# EAGLE design OBD_Board Ver1 (EAGLE 8.0.0)

## Sheet 1 of 2
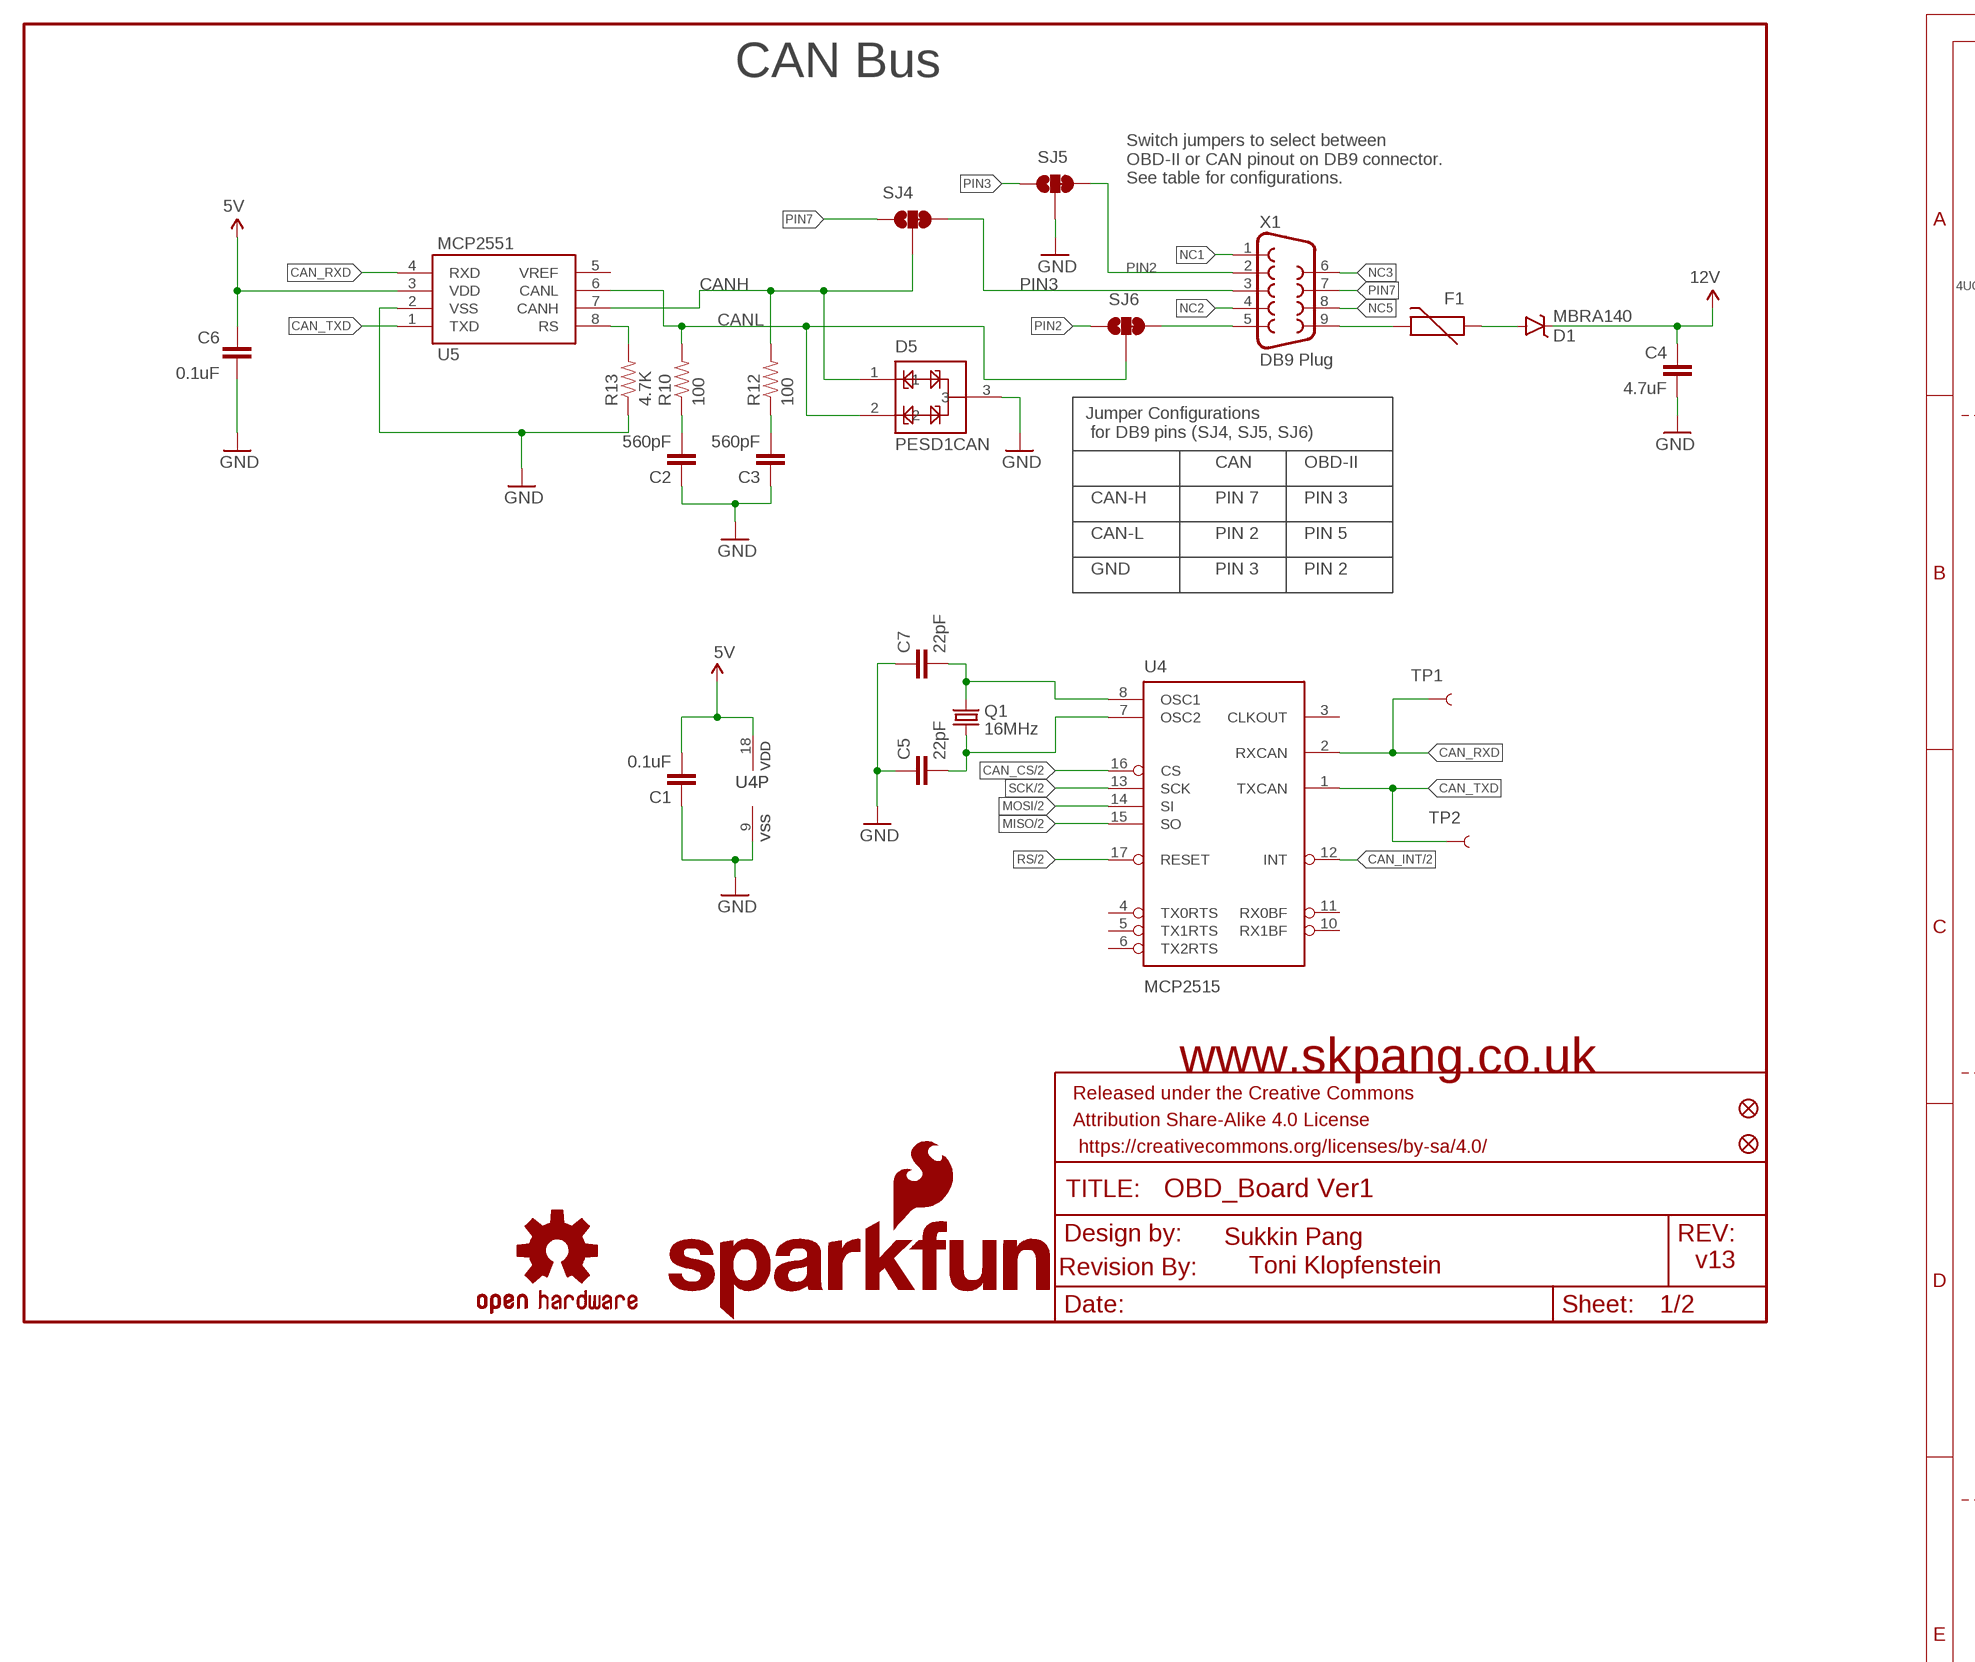
[diagram p0: schematic, sheet 1, part 1 of 2]
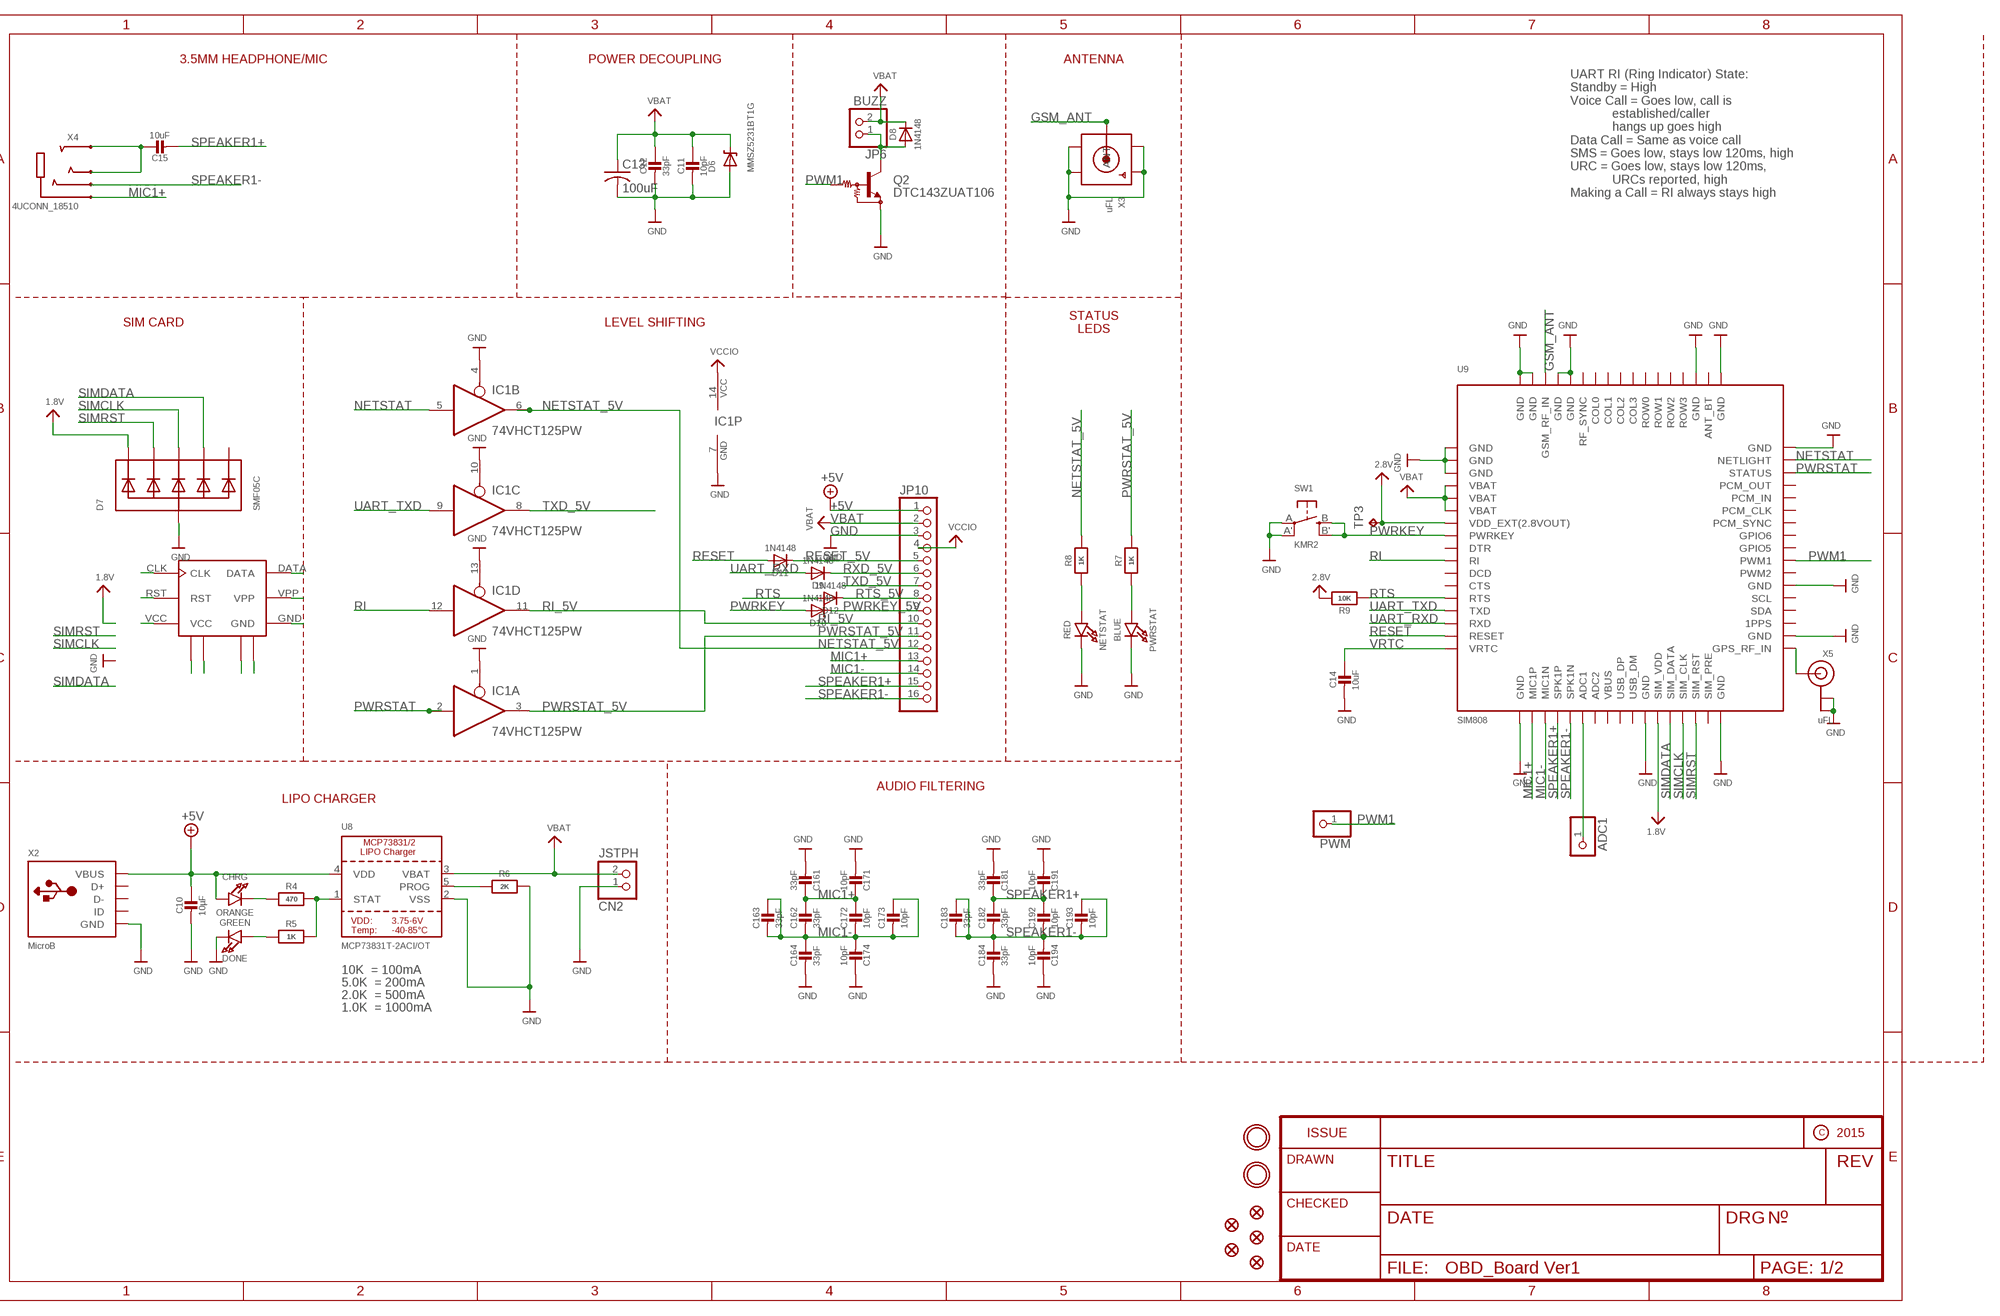
[diagram p1: schematic, sheet 1, part 2 of 2]

### Parts
ADC1  PINHD-1X1CB  [1X01-CLEANBIG]
C1  0.1uF  0.1UF-25V(+80/-20%)(0603)  [0603-CAP]
C2  560pF  560PF-50V-5%(0603)  [0603-CAP]
C3  560pF  560PF-50V-5%(0603)  [0603-CAP]
C4  4.7uF  4.7UF-6.3V-10%(0603)0603  [0603-CAP]
C5  22pF  22PF-50V-5%(0603)  [0603-CAP]
C6  0.1uF  0.1UF-25V(+80/-20%)(0603)  [0603-CAP]
C7  22pF  22PF-50V-5%(0603)  [0603-CAP]
C10  10µF  CAP_CERAMIC0805-NOOUTLINE  [0805-NO]
C11  10pF  CAP_CERAMIC0805-NOOUTLINE  [0805-NO]
C12  33pF  CAP_CERAMIC0805-NOOUTLINE  [0805-NO]
C13  100uF  C-USC1210  [C1210]
C14  10uF  CAP_CERAMIC0805-NOOUTLINE  [0805-NO]
C15  10uF  CAP_CERAMIC0805-NOOUTLINE  [0805-NO]
C16  33pF  CAP_4PACK1206  [RESPACK_4X0603]
C17  10pF  CAP_4PACK1206  [RESPACK_4X0603]
C18  33pF  CAP_4PACK1206  [RESPACK_4X0603]
C19  10pF  CAP_4PACK1206  [RESPACK_4X0603]
CHRG  ORANGE  LED0805_NOOUTLINE  [CHIPLED_0805_NOOUTLINE]
CN2  JSTPH  JST_2PIN  [JSTPH2]
D1  MBRA140  [SMA-DIODE]
D5  PESD1CAN  [SOT23-3]
D6  MMSZ5231BT1G  DIODE-ZENERSOD123  [SOD-123]
D7  SMF05C  TVSARRAY_5LANE  [SOT363]
D8  1N4148  DIODESOD-323  [SOD-323]
D9  1N4148  DIODESOD-323  [SOD-323]
D10  1N4148  DIODESOD-323  [SOD-323]
D11  1N4148  DIODESOD-323  [SOD-323]
D12  1N4148  DIODESOD-323  [SOD-323]
DONE  GREEN  LED0805_NOOUTLINE  [CHIPLED_0805_NOOUTLINE]
F1  PTCTHERMISTOR1206  [PTC-1206]
FID1  FIDUCIAL""  [FIDUCIAL_1MM]
FID2  FIDUCIAL""  [FIDUCIAL_1MM]
FID3  FIDUCIAL""  [FIDUCIAL_1MM]
FID4  FIDUCIAL""  [FIDUCIAL_1MM]
FID5  FIDUCIAL""  [FIDUCIAL_1MM]
FRAME1  FRAME-LETTER  [CREATIVE_COMMONS]
IC1  74VHCT125PW  74ABT125PW  [TSSOP14]
JP2  FIDUCIAL1X2  [FIDUCIAL-1X2]
JP3  FIDUCIAL1X2  [FIDUCIAL-1X2]
JP4  SFE_LOGO_NAME_FLAME.1_INCH  [SFE_LOGO_NAME_FLAME_.1]
JP6  BUZZ  HEADER-1X2ROUND  [1X02_ROUND]
JP10  HEADER-1X16ROUND  [1X16_ROUND]
LOGO1  OSHW-LOGOM  [OSHW-LOGO-M]
NETSTAT  RED  LED0805_NOOUTLINE  [CHIPLED_0805_NOOUTLINE]
PWM  PINHD-1X1CB  [1X01-CLEANBIG]
PWRSTAT  BLUE  LED0805_NOOUTLINE  [CHIPLED_0805_NOOUTLINE]
Q1  16MHz  CRYSTAL5X3  [CRYSTAL-SMD-5X3]
Q2  DTC143ZUAT106  MUN2211T1-NPN_DRIVER-SC59-BEC  [SC59-BEC]
R4  470  RESISTOR0805_NOOUTLINE  [0805-NO]
R5  1K  RESISTOR0805_NOOUTLINE  [0805-NO]
R6  2K  RESISTOR0805_NOOUTLINE  [0805-NO]
R7  1K  RESISTOR0805_NOOUTLINE  [0805-NO]
R8  1K  RESISTOR0805_NOOUTLINE  [0805-NO]
R9  10K  RESISTOR0805_NOOUTLINE  [0805-NO]
R10  100  100OHM-1/10W-1%(0603)  [0603-RES]
R12  100  100OHM-1/10W-1%(0603)  [0603-RES]
R13  4.7K  4.7KOHM-1/10W-1%(0603)  [0603-RES]
SJ4  JUMPER-PAD-3-2OF3_NC_BY_TRACE_SMALL  [PAD-JUMPER-3-2OF3_NC_BY_TRACE_YES_SILK_FULL_BOX]
SJ5  JUMPER-PAD-3-2OF3_NC_BY_TRACE_SMALL  [PAD-JUMPER-3-2OF3_NC_BY_TRACE_YES_SILK_FULL_BOX]
SJ6  JUMPER-PAD-3-2OF3_NC_BY_TRACE_SMALL  [PAD-JUMPER-3-2OF3_NC_BY_TRACE_YES_SILK_FULL_BOX]
SW1  KMR2  SWITCH_TACT_SMT4.6X2.8  [BTN_KMR2_4.6X2.8]
TP1  TEST-POINT3X5  [PAD.03X.05]
TP2  TEST-POINT3X5  [PAD.03X.05]
TP3  TPTP11R  [TP11R]
U4  MCP2515  MCP2510SO  [SO-18W]
U5  MCP2551  [SO08]
U8  MCP73831T-2ACI/OT  MCP73831/2  [SOT23-5]
U9  SIM808  GSM_SIM808_LITERAL  [SIM900_SMT]
U$1  REVISION  [REVISION]
U$25  SCU-W0822XR-06  [SCU-W0822XR-06]
U$33  MOUNTINGHOLE2.5  [MOUNTINGHOLE_2.5_PLATED]
U$34  MOUNTINGHOLE2.5  [MOUNTINGHOLE_2.5_PLATED]
X1  DB9 Plug  DB9MALE  [DB9_MALE]
X2  MicroB  USBMICRO_20329  [4UCONN_20329]
X3  uFL  SMACONNECTOR_EDGE_UFL  [SMA_EDGELAUNCH_UFL]
X4  4UCONN_18510  AUDIO_3.5MMJACK_4POL  [4UCONN_18510]
X5  uFL  ANTENNA_U.FL  [U.FL]

### Nets
1.8V: D7.1(C1) U9.P$29(SIM_VDD) U$25.VCC
2.8V: R9.2 TP3.TP U9.P$7(VDD_EXT(2.8VOUT))
5V: C1.2 C6.2 U4.18(VDD) U5.3(VDD) ; also sheet 2
12V: C4.1 D1.C ; also sheet 2
+5V: C10.1 CHRG.A JP10.1 U8.4(VDD) X2.VBUS
CAN_CS: U4.16(CS) ; also sheet 2
CAN_INT: U4.12(INT) ; also sheet 2
CAN_RXD: TP1.P$1 U4.2(RXCAN) U5.4(RXD)
CAN_TXD: TP2.P$1 U4.1(TXCAN) U5.1(TXD)
CANH: D5.1 R12.2 SJ4.2 U5.7(CANH)
CANL: D5.2 R10.2 SJ6.2 U5.6(CANL)
GND: C1.1 C2.1 C3.1 C4.2 C5.1 C6.1 C7.1 C10.2 C11.2 C12.2 C13.2 C14.2 C16.5 C16.8 C17.4 C17.8 C18.5 C18.8 C19.4 C19.8 CN2.1 D5.3 D6.A D7.2(A) DONE.C IC1.1(A:OE) IC1.4(B:OE) IC1.7(P:GND) IC1.10(C:OE) IC1.13(D:OE) JP10.3 NETSTAT.C PWRSTAT.C Q2.E R6.2 R13.1 SJ5.2 SW1.A'(P1) SW1.A(P) U4.9(VSS) U5.2(VSS) U8.2(VSS) U9.P$1(GND) U9.P$2(GND) U9.P$3(GND) U9.P$18(GND) U9.P$28(GND) U9.P$34(GND) U9.P$36(GND) U9.P$40(GND) U9.P$51(GND) U9.P$52(GND) U9.P$54(GND) U9.P$64(GND) U9.P$65(GND) U9.P$67(GND) U9.P$68(GND) U$25.GND U$25.GND_1(GND1) U$25.GND_2(GND2) U$25.GND_3(GND3) U$25.GND_4(GND4) X2.BASE@1(GND) X2.BASE@2(GND) X2.GND X2.SPRT@1(GND) X2.SPRT@2(GND) X2.SPRT@3(GND) X2.SPRT@4(GND) X3.GND@1(GND1) X3.GND@2(GND2) X3.GND@3(GND3) X3.GND@4(GND4) X5.1(GND) X5.2(GND) ; also sheet 2
GSM_ANT: U9.P$66(GSM_RF_IN) X3.P(ANT)
HP+: C15.1 X4.2-TIP(RING3) X4.3-OUTER_SLEEVE(RING2)
MIC1+: C16.1 C16.2 C17.1 C17.2 JP10.13 U9.P$19(MIC1P) X4.1-GND(TIP)
MIC1-: C16.3 C16.4 C16.6 C16.7 C17.3 C17.5 C17.6 C17.7 JP10.14 U9.P$20(MIC1N)
MISO: U4.15(SO) ; also sheet 2
MOSI: U4.14(SI) ; also sheet 2
N$2: SJ6.3 X1.5
N$3: CHRG.C R4.1
N$7: R4.2 R5.2 U8.1(STAT)
N$8: R6.1 U8.5(PROG)
N$9: C2.2 R10.1
N$10: C3.2 R12.1
N$11: DONE.A R5.1
N$12: PWRSTAT.A R7.1
N$13: F1.2 X1.9
N$14: R13.2 U5.8(RS)
N$16: D1.A F1.1
N$17: C7.2 Q1.3 U4.8(OSC1)
N$18: C5.2 Q1.1 U4.7(OSC2)
N$20: NETSTAT.A R8.1
N$23: D8.A JP6.1 Q2.C
N$25: U9.P$35(GPS_RF_IN) X5.3(SIGNAL)
N$26: ADC1.1 U9.P$23(ADC1)
N$31: U$25.VPP
NC1: X1.1
NC2: X1.4
NC3: X1.6
NC5: X1.8
NETSTAT: IC1.5(B:I) U9.P$50(NETLIGHT)
NETSTAT_5V: IC1.6(B:O) JP10.12 R8.2
PIN2: SJ5.3 SJ6.1 X1.2
PIN3: SJ4.3 SJ5.1 X1.3
PIN7: SJ4.1 X1.7
PWM1: PWM.1 Q2.B U9.P$42(PWM1)
PWRKEY: D10.A SW1.B'(S1) SW1.B(S) U9.P$8(PWRKEY)
PWRKEY_5V: D10.C JP10.9
PWRSTAT: IC1.2(A:I) U9.P$49(STATUS)
PWRSTAT_5V: IC1.3(A:O) JP10.11 R7.2
RESET: D11.A U9.P$16(RESET)
RESET_5V: D11.C JP10.5
RI: IC1.12(D:I) U9.P$10(RI)
RI_5V: IC1.11(D:O) JP10.10
RS: U4.17(RESET) ; also sheet 2
RTS: D12.A R9.1 U9.P$13(RTS)
RTS_5V: D12.C JP10.8
RXD_5V: D9.C JP10.6
SCK: U4.13(SCK) ; also sheet 2
SIMCLK: D7.4(C3) U9.P$31(SIM_CLK) U$25.CLK
SIMDATA: D7.5(C4) U9.P$30(SIM_DATA) U$25.DATA
SIMRST: D7.3(C2) U9.P$32(SIM_RST) U$25.RST
SPEAKER1+: C15.2 C18.1 C18.2 C19.1 C19.2 JP10.15 U9.P$21(SPK1P)
SPEAKER1-: C18.3 C18.4 C18.6 C18.7 C19.3 C19.5 C19.6 C19.7 JP10.16 U9.P$22(SPK1N) X4.4-INNER_SLEEVE(RING1)
TXD_5V: IC1.8(C:O) JP10.7
UART_RXD: D9.A U9.P$15(RXD)
UART_TXD: IC1.9(C:I) U9.P$14(TXD)
VBAT: C11.1 C12.1 C13.1 CN2.2 D6.C D8.C JP6.2 JP10.2 U8.3(VBAT) U9.P$4(VBAT) U9.P$5(VBAT) U9.P$6(VBAT)
VCCIO: IC1.14(P:VCC) JP10.4
VRTC: C14.1 U9.P$17(VRTC)
Unconnected: D7.6(C5) U4.3(CLKOUT) U4.4(TX0RTS) U4.5(TX1RTS) U4.6(TX2RTS) U4.10(RX1BF) U4.11(RX0BF) U5.5(VREF) U9.P$9(DTR) U9.P$11(DCD) U9.P$12(CTS) U9.P$24(ADC2) U9.P$26(USB_DP) U9.P$27(USB_DM) U9.P$33(SIM_PRE) U9.P$37(1PPS) U9.P$38(SDA) U9.P$39(SCL) U9.P$41(PWM2) U9.P$43(GPIO5) U9.P$44(GPIO6) U9.P$45(PCM_SYNC) U9.P$46(PCM_CLK) U9.P$47(PCM_IN) U9.P$48(PCM_OUT) U9.P$53(ANT_BT) U9.P$55(ROW3) U9.P$56(ROW2) U9.P$57(ROW1) U9.P$58(ROW0) U9.P$59(COL3) U9.P$60(COL2) U9.P$61(COL1) U9.P$62(COL0) U9.P$63(RF_SYNC) X2.D+ X2.D- X2.ID

### Notes on the sheet
- CAN Bus | 3.5MM HEADPHONE/MIC | POWER DECOUPLING | ANTENNA
- Switch jumpers to select between 
  OBD-II or CAN pinout on DB9 connector. 
  See table for configurations.
- UART RI (Ring Indicator) State:
  Standby = High
  Voice Call = Goes low, call is 
              established/caller 
              hangs up goes high
  Data Call = Same as voice call
  SMS = Goes low, stays low 120ms, high
  URC = Goes low, stays low 120ms,
              URCs reported, high
  Making a Call = RI always stays high
- Jumper Configurations
   for DB9 pins (SJ4, SJ5, SJ6)
- SIM CARD | LEVEL SHIFTING
- STATUS
  LEDS
- CAN | OBD-II
- CAN-H | PIN 7 | PIN 3
- CAN-L | PIN 2 | PIN 5
- GND | PIN 3 | PIN 2
- www.skpang.co.uk
- AUDIO FILTERING
- LIPO CHARGER
- Sukkin Pang
- Toni Klopfenstein | v13
- 10K  = 100mA
- 5.0K  = 200mA
- 2.0K  = 500mA
- 1.0K  = 1000mA

## Sheet 2 of 2
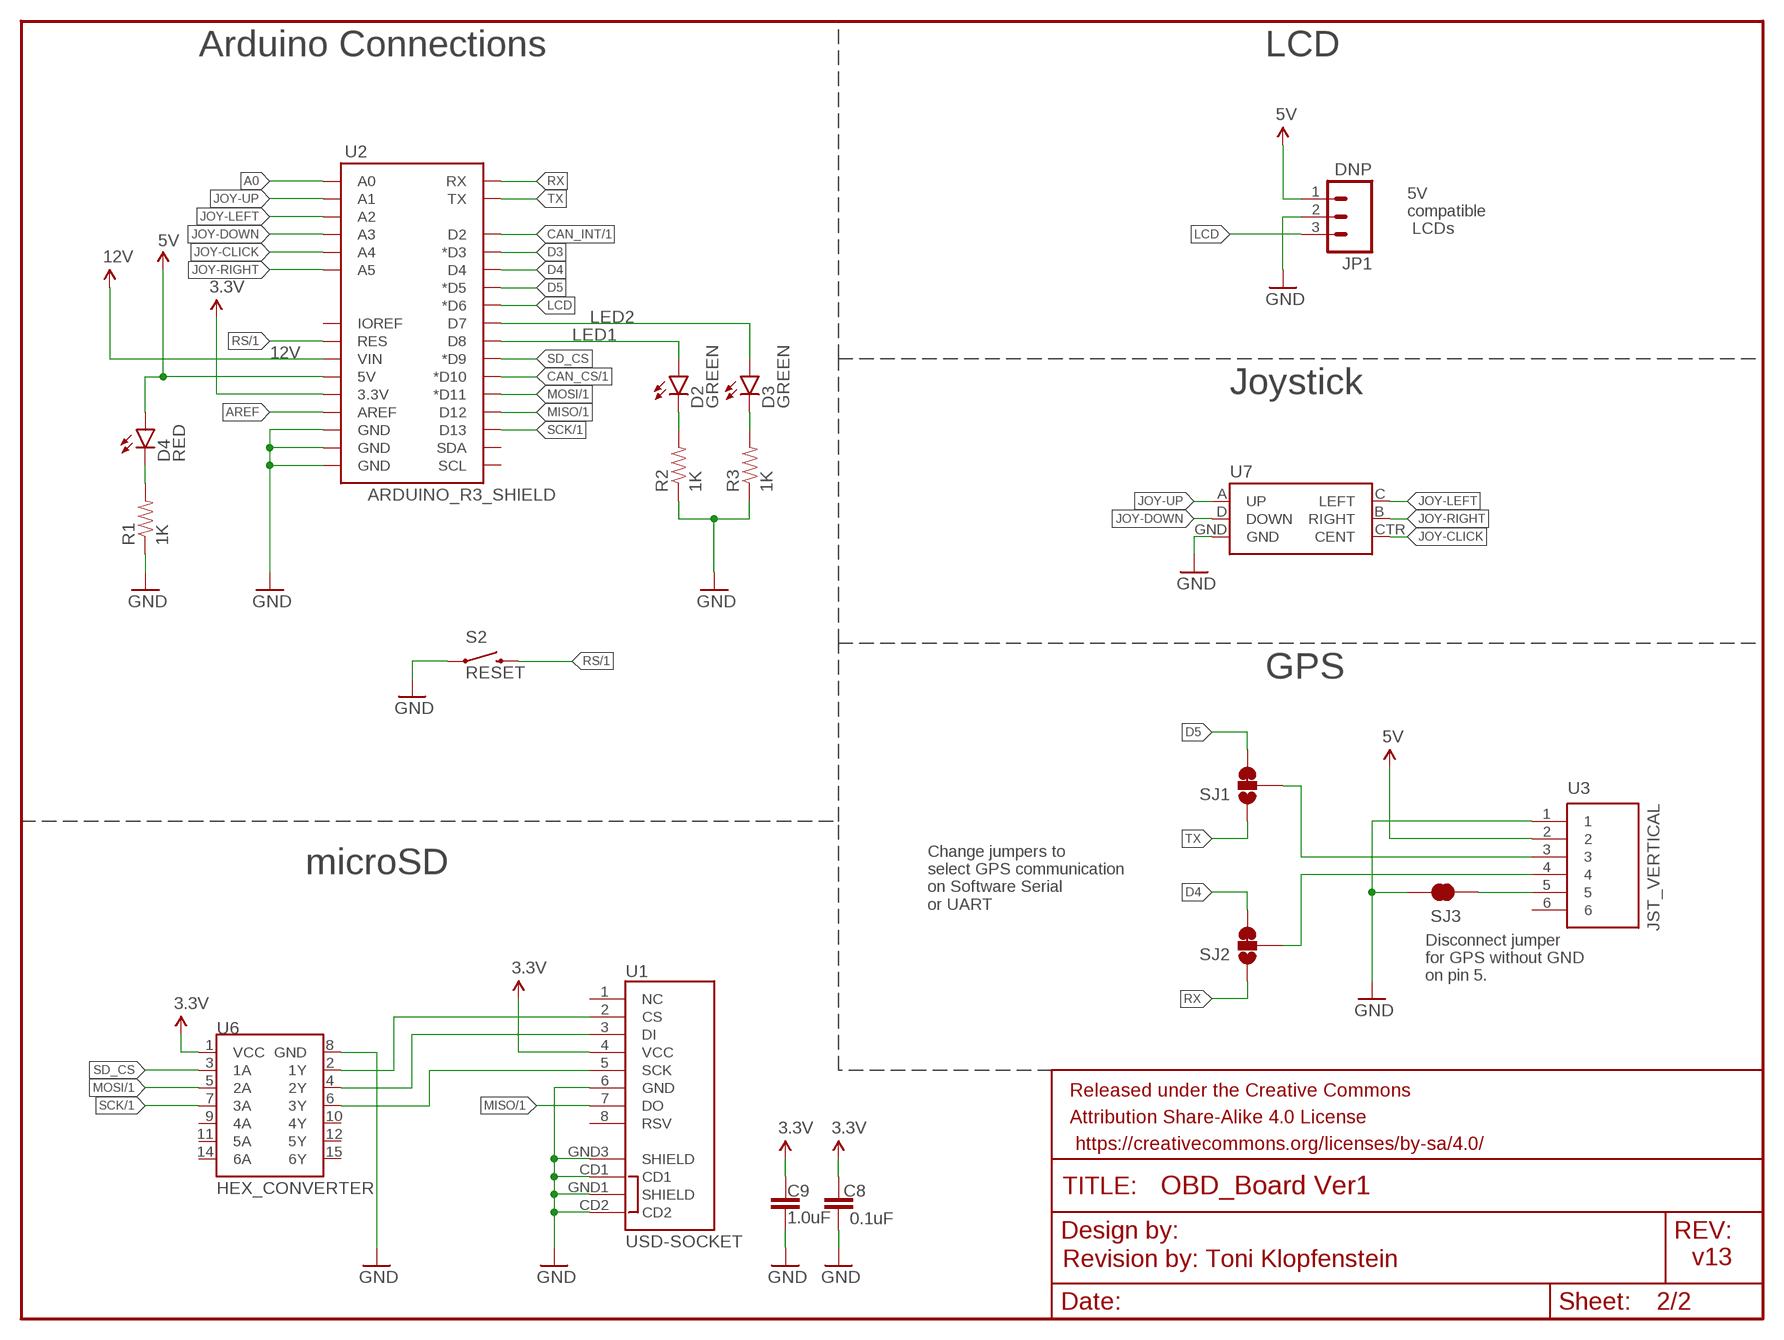
[diagram p2: schematic, sheet 2]

### Parts
C8  0.1uF  0.1UF-25V(+80/-20%)(0603)  [0603-CAP]
C9  1.0uF  1.0UF-16V-10%(0603)  [0603-CAP]
D2  GREEN  LED-GREEN0603  [LED-0603]
D3  GREEN  LED-GREEN0603  [LED-0603]
D4  RED  LED-RED0603  [LED-0603]
FRAME2  FRAME-LETTERNO_PACKAGE  [DUMMY]
JP1  DNP  M03POLAR_LOCK  [MOLEX-1X3_LOCK]
R1  1K  1KOHM-1/10W-1%(0603)  [0603-RES]
R2  1K  1KOHM-1/10W-1%(0603)  [0603-RES]
R3  1K  1KOHM-1/10W-1%(0603)  [0603-RES]
S2  RESET  SWITCH-MOMENTARY-2SMD  [TACTILE-SWITCH-SMD]
SJ1  JUMPER-PAD-3-2OF3_NC_BY_TRACE_SMALL  [PAD-JUMPER-3-2OF3_NC_BY_TRACE_YES_SILK_FULL_BOX]
SJ2  JUMPER-PAD-3-2OF3_NC_BY_TRACE_SMALL  [PAD-JUMPER-3-2OF3_NC_BY_TRACE_YES_SILK_FULL_BOX]
SJ3  JUMPER-PAD-2-NC_BY_TRACE  [PAD-JUMPER-2-NC_BY_TRACE_YES_SILK]
U1  USD-SOCKET  [MICROSD_1:1]
U2  ARDUINO_R3_SHIELD  [UNO_R3_SHIELD]
U3  JST_VERTICAL  [JST-6-SMD-VERT-1.0MM]
U6  HEX_CONVERTER  [SO016]
U7  JOYSTICK_MINI  [JOYSTICK_MINI]

### Nets
3.3V: C8.2 C9.1 U1.4(VCC) U2.3.3V U6.1(VCC)
5V: D4.A JP1.1 U2.5V U3.2 ; also sheet 1
12V: U2.VIN ; also sheet 1
A0: U2.A0
AREF: U2.AREF
CAN_CS: U2.D10(*D10) ; also sheet 1
CAN_INT: U2.D2 ; also sheet 1
D3: U2.D3(*D3)
D4: SJ2.3 U2.D4
D5: SJ1.3 U2.D5(*D5)
GND: C8.1 C9.2 JP1.2 R1.1 R2.1 R3.1 S2.1 SJ3.2 U1.6(GND) U1.CD1 U1.CD2 U1.GND1(SHIELD) U1.GND3(SHIELD) U2.GND@0(GND) U2.GND@1(GND) U2.GND@2(GND) U3.1 U6.8(GND) U7.GND ; also sheet 1
JOY-CLICK: U2.A4 U7.CTR(CENT)
JOY-DOWN: U2.A3 U7.D(DOWN)
JOY-LEFT: U2.A2 U7.C(LEFT)
JOY-RIGHT: U2.A5 U7.B(RIGHT)
JOY-UP: U2.A1 U7.A(UP)
LCD: JP1.3 U2.D6(*D6)
LED1: D2.A U2.D8
LED2: D3.A U2.D7
MISO: U1.7(DO) U2.D12 ; also sheet 1
MOSI: U2.D11(*D11) U6.5(2A) ; also sheet 1
N$1: SJ3.1 U3.5
N$4: D4.C R1.2
N$5: D2.C R2.2
N$6: D3.C R3.2
N$15: U1.2(CS) U6.2(1Y)
N$19: U1.3(DI) U6.4(2Y)
N$21: SJ1.2 U3.3
N$22: SJ2.2 U3.4
N$24: U1.5(SCK) U6.6(3Y)
RS: S2.3 U2.RES ; also sheet 1
RX: SJ2.1 U2.RX
SCK: U2.D13 U6.7(3A) ; also sheet 1
SD_CS: U2.D9(*D9) U6.3(1A)
TX: SJ1.1 U2.TX
Unconnected: U1.1(NC) U1.8(RSV) U2.IOREF U2.SCL U2.SDA U3.6 U6.9(4A) U6.10(4Y) U6.11(5A) U6.12(5Y) U6.14(6A) U6.15(6Y)

### Notes on the sheet
- Arduino Connections | LCD
- 5V 
  compatible
   LCDs
- Joystick
- GPS
- microSD
- Change jumpers to 
  select GPS communication
  on Software Serial 
  or UART
- Disconnect jumper
  for GPS without GND
  on pin 5.
- Revision by: Toni Klopfenstein | v13

## Power pins joined to a net without a drawn wire
VBUS: U9.P$25(VBUS)

## Library data of the parts
ADC1 PWM = adafruit:PINHD-1X1: Pin header 1x1 for 0.1" spacing With round pins
C1 C6 C8 = SparkFun-Capacitors:0.1UF-25V(+80/-20%)(0603): CAP-00810 Ceramic Standard decoupling cap; PROD_ID: CAP-00810
C2 C3 = SparkFun-Capacitors:560PF-50V-5%(0603): CAP-08749; PROD_ID: CAP-08749
C4 = SparkFun-Capacitors:4.7UF-6.3V-10%(0603): CAP-08280; PROD_ID: CAP-08280
C5 C7 = SparkFun-Capacitors:22PF-50V-5%(0603): CAP-07876; PROD_ID: CAP-07876
C9 = SparkFun-Capacitors:1.0UF-16V-10%(0603): CAP-00868; PROD_ID: CAP-00868
C10-C12 C14 C15 = microbuilder:CAP_CERAMIC: Ceramic Capacitors For new designs, use the packages preceded by an '_' character since they are more reliable: The following footprints should be used on most boards: _0402 - Standard footprint for regular board layouts _0603 - Standard footprint for regular board layouts _0805 - Standard footprint for regular board layouts _1206 - Standard footprint for regular board layouts For extremely tight-pitch boards where space is at a premium, the following 'micro-pitch' footprints can be used (smaller pads, no silkscreen outline, etc.): _0402MP - Micro-pitch footprint for very dense/compact boards _0603MP - Micro-pitch footprint for very dense/compact boards _0805MP - Micro-pitch footprint for very dense/compact boards _1206MP - Micro-pitch footprint for very dense/compact boards
C13 = rcl:C-US: CAPACITOR, American symbol
C16-C19 = microbuilder:CAP_4PACK
CHRG DONE NETSTAT PWRSTAT = microbuilder:LED: LED 0603 - 0603 Surface Mount Package 2mA: Green LED - Low Power (3.9mcd, 2ma, 1.7Vf) - Digikey: 475-2709-2-ND Orange LED - Low Power (9.8mcd, 2ma, 1.8Vf) - Digikey: 475-1194-2-ND Red LED - Low Power (5mcd, 2ma, 1.8Vf) - Digikey: 475-1195-2-ND Yellow LED - Low Power (7mcd, 2ma, 1.8Vf) - Digikey: 475-1196-2-ND 5mA: Blue LED - Low Power (17mcd, 5ma, 2.9Vf) - Digikey: LNJ937W8CRACT-ND 0805 - 0805 Surface Mount Package 2mA: Red LED (8.8mcd, 2mA, 1.8Vf, Clear) - Low Power [Digikey: 475-2510-1-ND] Green LED (5mcd, 2mA, 1.8Vf, Clear) - Low Power [Digikey: 475-2730-1-ND] Yellow LED (11.3mcd, 2mA, 1.8Vf, Clear) - Low Power [Digikey: 475-2555-1-ND] 20mA: Red LED (104mcd, 20mA, Diffused) - LS R976 [Digikey: 475-1278-6-ND] Red LED (12mcd, 20mA, 2.0Vf, Clear) - APT2012EC [Digikey: 754-1128-1-ND] Green LED (15mcd, 20mA, 2.2Vf, Clear) - APT2012GC [Digikey: 754-1131-1-ND] Orange LED (160mcd, 20mA, 2.1Vf, Clear) - APT2012SECK [Digikey: 754-1130-1-ND] 1206 - 1206 Surface Mount Package Green LED (26mcd, 20mA, Diffused) - LG N971 [Digikey: 475-1407-6-ND] Red LED (15mcd, 20mA, Diffused) - LH N974 [Digikey: 475-1416-6-ND] Cree - Cree High-Power Surface Mount LEDs XPEBWT-L1-0000-00D50 - White 111lm 350mA 2.9Vf 6200K 110° XTEAWT-00-0000-00000LEE3 - White 114lm 350mA 2.85Vf 5000K 115° Everlight - Everlight 45-21 Series Surface Mount LEDs 45-21/QK2C-B2832AC2CB2/2T - Warm White 2000mcd 20mA 3.25Vf 3050K 120° 45-21/LK2C-B38452C4CB2/2T - Nuetral White 2000mcd 20mA 3.25Vf 4150K 120° 45-21/LK2C-B50634C6CB2/2T - Cold White 2200mcd 20mA 3.25Vf 5650K 120° PLCC2 Reverse Mount LS T77K-J1L2-1-0-2-R18-Z - Red 11.25mcd 2mA 1.8Vf 630nm 120° LO T77K-L1M2-24-Z - Orange 19.6mcd 2mA 1.8Vf 606nm 120° LY T77K-K2M1-26-Z - Yellow 15.7mcd 2mA 1.8Vf 587nm 120°
CN2 = microbuilder:JST_2PIN: JST 2-Pin Right-Angle Connector PH-Series - 4UConnector: 17311 SH-Series - 4UConnector: 07278
D1 = SparkFun-DiscreteSemi:MBRA140: 40V, 1A Schottky rectifier SMA/DO-214AC package DIO-08053; PROD_ID: DIO-08053
D2 D3 = SparkFun-LED:LED-GREEN: Various green LEDs Green LEDs used in SFE Production 0603- DIO-00821 LARGE- DIO-00862 LILYPAD- DIO-09910; PROD_ID: DIO-00821
D4 = SparkFun-LED:LED-RED: Assorted Red LEDs LilyPad 1206- DIO-09912 1206- DIO-00809 0603- DIO-00819 "SMART" means more efficient and expensive; PROD_ID: DIO-00819
D5 = SparkFun-DiscreteSemi:PESD1CAN: PESD1CAN is used to protect two automotive CAN bus lines from ESD.; PROD_ID: DIO-12501
D6 = microbuilder:DIODE-ZENER: Zener Diode SMA: 30V 1W Zener Diode, 1.2Vf - Digikey: SMAZ30-FDICT-ND
D7 = microbuilder:TVSARRAY_5LANE: Voltage Transient Suppressor Array SOT363 SMF05C - 100W 5V: Digikey - SMF05CT1GOSCT-ND
D8-D12 = microbuilder:DIODE: Diode SMA Model Volts Amps Type Vf Ir Digikey # Notes SSA34-E3 40V 3A Schottky 480mV @ 3A 200uA @ 40V SSA34-E3/61TGITR-ND CDBA120-G 20V 1A Schottky 500mV @ 1A 500uA @ 20V 641-1014-6-ND REEL MBRA210 10V 2A Schottky 350mV @ 2A 700uA @ 10V MBRA210LT3 SOD-123 Model Volts Amps Type Vf Ir Order # Notes BAT54T1G 30V 200mA Schottky 800mV @ 200mA 2uA @ 25V BAT54T1GOSTR-ND B0530W 30V 500mA Schottky 430mV @ 500mA 130uA @ 30V B0530W-FDICT-ND REEL MBR120 20V 1A Schottky 340mV @ 1A MBR120VLSFT1GOSCT-ND SOD-323 Model Volts Amps Type Vf Ir Order # Notes PMEG2005EJ 20V 500mA Schottky 355mV @ 500mA 568-4110-1-ND ZLLS410 10V 570mA Schottky 380mV @ 570mA ZLLS410CT-ND 1N4148WS 75V 150mA Silicon/Simple 1V 1N4148WSFSCT-ND REEL SOD-523 Model Volts Amps Type Vf Ir Order # Notes BAT54XV2 30V 200mA Schottky 0.8V @ 100mA BAT54XV2CT-ND TB751S 30V 30mA Schottky RB751S-40TE61CT-ND SOT23-R/W (R = Solder Paste/Reflow Ovens, W = Hand-Soldering) Model Volts Amps Type Vf Ir Order # Notes BAT54FILM 40V 300mA Schottky 497-7162-1-ND POWERDI-5 Model Volts Amps Type Vf Ir Order # Notes PDS560 60V 5A Schottky 670mV @ 5A 150uA @ 60V PDS560DICT-ND
F1 = SparkFun-PowerIC:PTC: Resettable Fuse PTC Resettable Fuse. Spark Fun Electronics SKU : COM-08357; PROD_ID: RES-08585
FID1-FID5 = microbuilder:FIDUCIAL: Fiducial Alignment Points Various fiducial points for machine vision alignment.; BOM: EXCLUDE
FRAME1 = SparkFun-Aesthetics:FRAME-LETTER: Schematic Frame Standard 8.5x11 US Letter frame
FRAME2 = SparkFun-Aesthetics:FRAME-LETTER: Schematic Frame Standard 8.5x11 US Letter frame; DESIGNER: Sukkin Pang and Ryan Owens; VERSION: v13
IC1 = 74xx-us:74*125: Quad bus BUFFER, 3-state
JP1 = SparkFun-Connectors:M03: Header 3 Standard 3-pin 0.1" header. Use with straight break away headers (SKU : PRT-00116), right angle break away headers (PRT-00553), swiss pins (PRT-00743), machine pins (PRT-00117), and female headers (PRT-00115). Molex polarized connector foot print use with SKU : PRT-08232 with associated crimp pins and housings.
JP2 JP3 = SparkFun-Aesthetics:FIDUCIAL: Fiducial Alignment Points Various fiducial points for machine vision alignment.
JP4 = SparkFun-Aesthetics:SFE_LOGO_NAME_FLAME: SFE Logo, name and flame This is the SparkFun full logo. The logo on the schematic will always be the same size; the package variant is the height of the flame part of the logo. Default layer for the logo on the board is tSilk.
JP6 = microbuilder:HEADER-1X2: PIN HEADER
JP10 = microbuilder:HEADER-1X16: PIN HEADER
LOGO1 = SparkFun-Aesthetics:OSHW-LOGO: Open Source Hardware Logo This logo indicates the piece of hardware it is found on incorporates a OSHW license and/or adheres to the definition of open source hardware found here: http://freedomdefined.org/OSHW
Q1 = SparkFun-FreqCtrl:CRYSTAL: Various standard crystals. Proven footprints.; PROD_ID: XTAL-08218
Q2 = transistor:*-NPN_DRIVER-: NPN Bias Resistor Transistor
R1-R3 = SparkFun-Resistors:1KOHM-1/10W-1%(0603): RES-07856; PROD_ID: RES-07856
R4-R9 = microbuilder:RESISTOR: Resistors For new designs, use the packages preceded by an '_' character since they are more reliable: The following footprints should be used on most boards: _0402 - Standard footprint for regular board layouts _0603 - Standard footprint for regular board layouts _0805 - Standard footprint for regular board layouts _1206 - Standard footprint for regular board layouts For extremely tight-pitch boards where space is at a premium, the following 'micro-pitch' footprints can be used (smaller pads, no silkscreen outline, etc.): _0402MP - Micro-pitch footprint for very dense/compact boards _0603MP - Micro-pitch footprint for very dense/compact boards _0805MP - Micro-pitch footprint for very dense/compact boards _1206MP - Micro-pitch footprint for very dense/compact boards
R10 R12 = SparkFun-Resistors:100OHM-1/10W-1%(0603): RES-07863; PROD_ID: RES-07863
R13 = SparkFun-Resistors:4.7KOHM-1/10W-1%(0603): RES-07857; PROD_ID: RES-07857
S2 = SparkFun-Electromechanical:SWITCH-MOMENTARY-2: Various NO switches- pushbuttons, reed, etc; PROD_ID: SWCH-08247
SJ1 SJ2 SJ4-SJ6 = SparkFun-Passives:JUMPER-PAD-3-2OF3_NC_BY_TRACE
SJ3 = SparkFun-Passives:JUMPER-PAD-2-NC_BY_TRACE
SW1 = microbuilder:SWITCH_TACT_SMT: SMT Tact Switches 6x6mm - Digikey: P12940SCT-ND KMR2 (4.6x2.8mm) - Digikey: 401-1426-1-ND EVQ-PQHB55 - Light Touch, 160GF (4.5x4.5mm) - Digikey: P8090SCT-ND KMT0 - KMT021 NGJ LHS (etc.) IP68/Waterproof - Digikey: CKN10289CT-ND
TP1 TP2 = SparkFun-Passives:TEST-POINT: Bare copper test points for troubleshooting or ICT
TP3 = testpad:TP: Test pad
U1 = SparkFun-Connectors:USD-SOCKET: microSD Socket Push-push type uSD socket. Schematic element and footprint production proven. Spark Fun Electronics SKU : PRT-00127. tDoc lines correctly indicate media card edge positions when inserting (unlocked, locked, depressed). NOTE: CD1 and CD2 are connected internally; PROD_ID: CONN-07820
U2 = SparkFun-Boards:ARDUINO_R3_SHIELD: Shield form compatible with the Arduino Uno R3.
U3 = SparkFun-Connectors:JST_VERTICAL; PROD_ID: CONN-08249
U4 = SparkFun-DigitalIC:MCP2510: CAN controller with SPI interface to any MCU. Original design by Microchip.; PROD_ID: IC-09906
U5 = SparkFun-DigitalIC:MCP2551: CAN transceiver; PROD_ID: IC-09907
U6 = SparkFun-DigitalIC:HEX_CONVERTER: 74HC4050 Hex Buffer Level Shifter SMD SO016; PROD_ID: IC-09604
U7 = SparkFun-Electromechanical:JOYSTICK_MINI: Small 5-way tactile joystick, COM-10063 4UCON SF303GJ26; PROD_ID: SWCH-09905
U8 = microbuilder:MCP73831/2: MCP73831/2 LIPO Charger VDD: 3.75 - 6V Temp -40 - 85°C Programmable Charge Rate: 15-500mA NOTE: STAT is a tri-state logic output on the MCP73831 and an open-drain output on the MCP73832. SOT23-5 with 4.2V output and tri-state logic on STAT = MCP73831T-2ACI/OT
U9 = microbuilder:GSM_SIM808_LITERAL: SIM808 GSM Module
U$1 = SparkFun-Aesthetics:REVISION
U$25 = con-sim:SCU-W0822XR-06
U$33 U$34 = microbuilder:MOUNTINGHOLE: Mounting Hole For #2 screws (0.086"/2.18mm width, 0.094"/2.4mm hole) use 2.5mm; BOM: EXCLUDE
X1 = SparkFun-Connectors:DB9: DB9 Connector Standard DB9 (D-Sub 9) serial connector. Can be used for CAN bus as well as RS485 and RS232. Footprint production proven. Spark Fun Electronics SKU : PRT-00429; PROD_ID: CONN-09904
X2 = microbuilder:USB: USB Connectors USBMINIB - Surface Mount Female Mini-B USB Connector 4UConnector: 06564
X3 = microbuilder:SMACONNECTOR: SMA Connector 90° DIP SMA Connector, 50 Ohm (4UConnector: 07259)
X4 = microbuilder:AUDIO_3.5MMJACK_4POL: Footprint courtesy Morten Hjerde (Riftlabs.com) These are normally connected as follows (4-pin 3.5mm 'TRRS'), from left-to right on the schematic symbol above: Tip: Left Audio Outermost Ring: Right Audio Innermost Ring: Common/GND Shell: Mic+
X5 = microbuilder:ANTENNA_U.FL: U.FL Antenna Connector

## Board
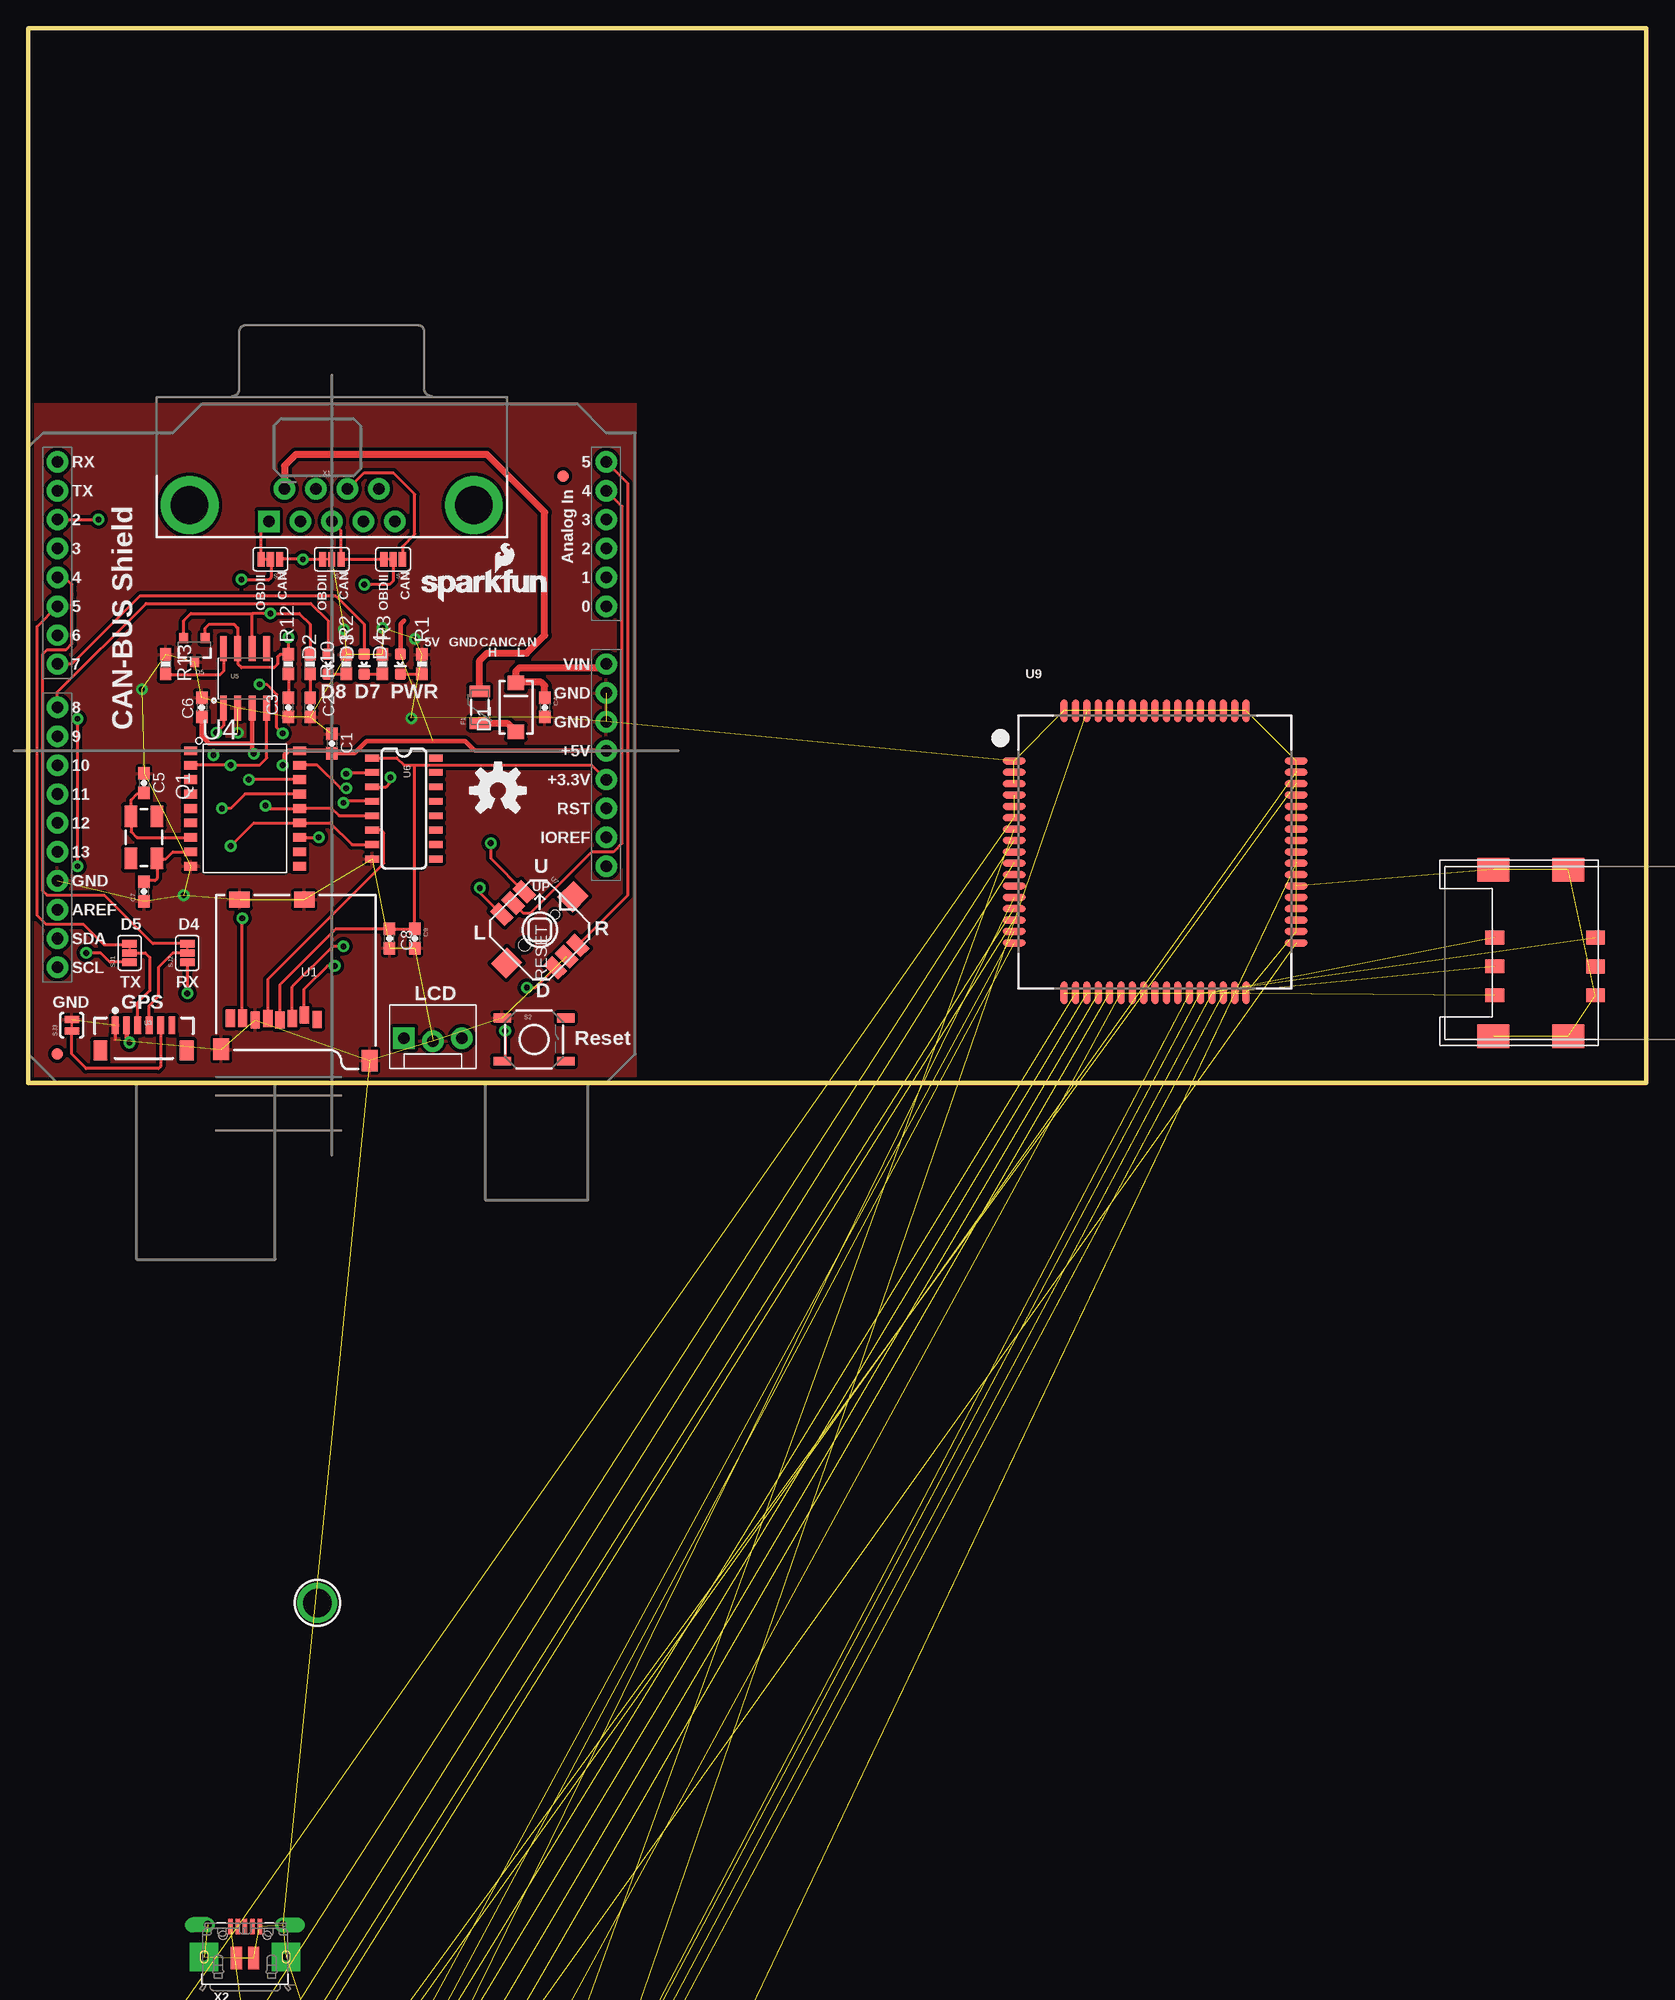
[diagram p3: board, top side]
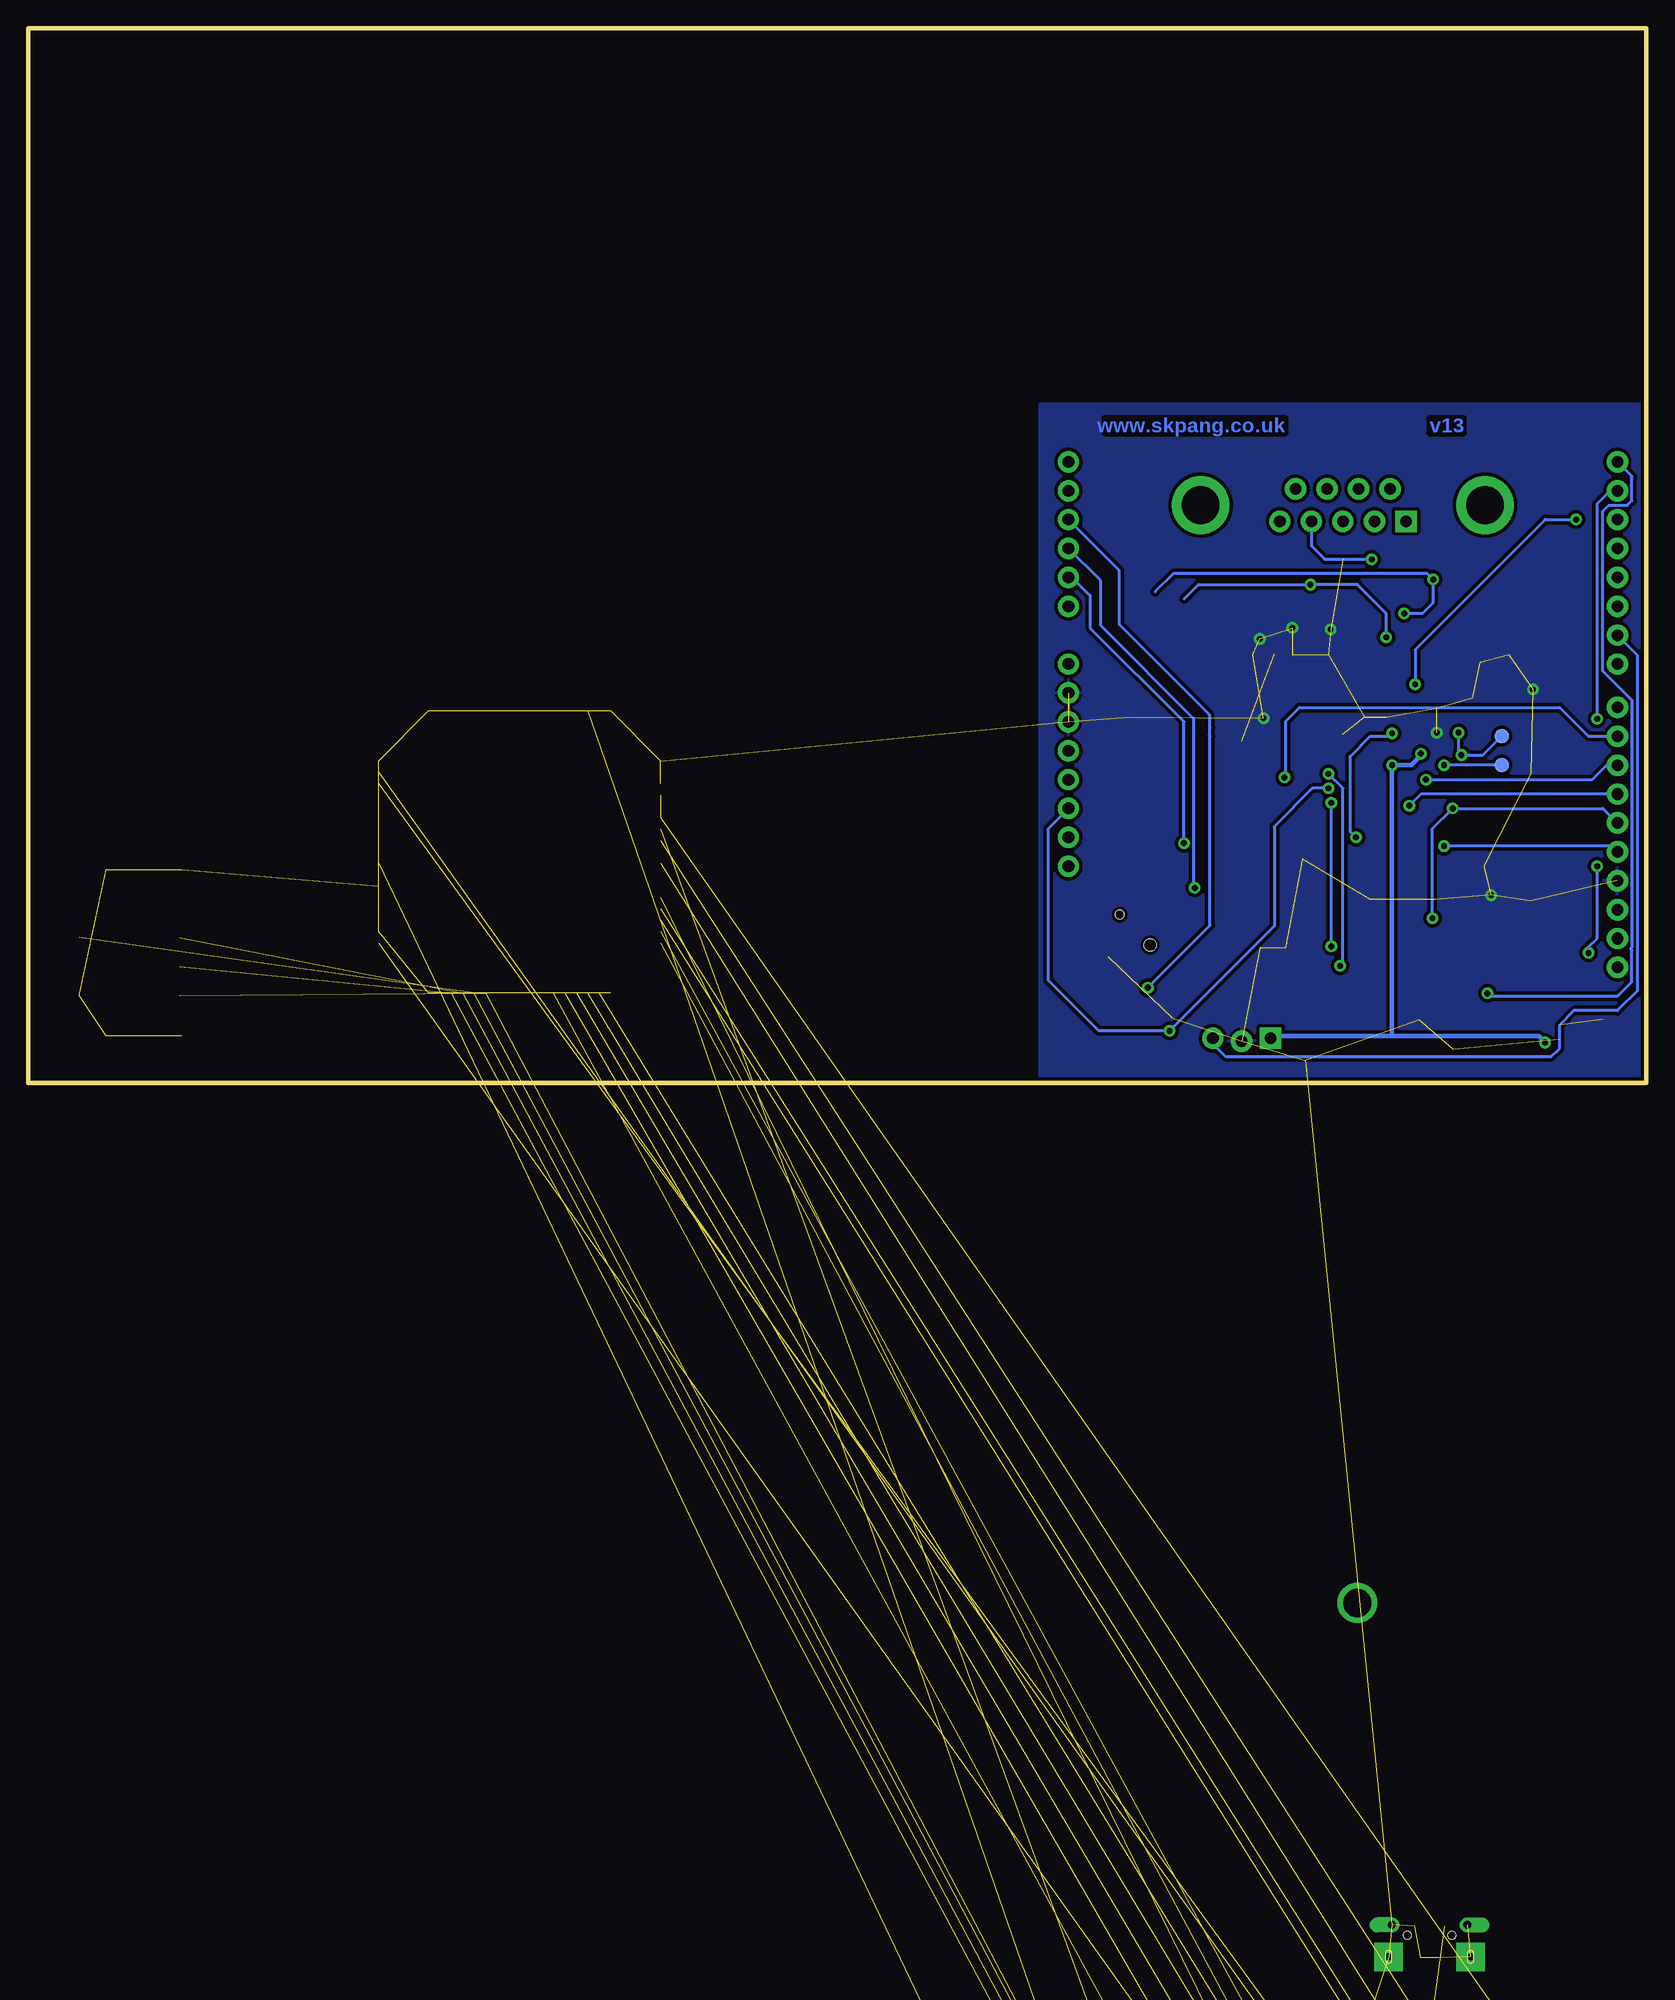
[diagram p4: board, bottom side, seen from below]

Size 142.24 x 92.71 mm. Coordinates in mm from the lower left corner, seen from the top.
Outline: 0,0 142.24,0 142.24,92.71 0,92.71 0,0
Copper layers (1*16): Top 0.035mm / dielectric 1.5mm / Bottom 0.035mm
Design rules "SparkFun-2-layer": minimum track width 7mil, minimum drill 15mil, track to track 8mil, track to pad 8mil, pad to pad 8mil, via to via 8mil, smd to smd 8mil, copper to edge 8mil, drill to drill 8mil, minimum pad ring 12mil, minimum via ring 10mil, stop-mask expansion 4mil, vias tented up to drill 20mil, thermal gap 10mil
tRestrict: area 17.1,34.3 to 18.7,35.2; area 15.6,18.7 to 22.5,20; area 21.9,29.2 to 22.2,29.5; area 34.3,19.1 to 34.6,19.4

### Footprints (pad centres in the part's own frame; a part is rotated, then mirrored left to right if it is on the bottom)
1X01-CLEANBIG = drill 1.016 pad 1.778: 1 0,0
0603-CAP = smd 1.1 x 1: 1 -0.85,0; 2 0.85,0
0805-NO = smd 1.3 x 1.5: 1 -0.95,0; 2 0.95,0
C1210 = smd 1.6 x 2.7: 1 -1.4,0; 2 1.4,0
RESPACK_4X0603 = smd 0.45 x 0.9: 1 -1.3,-0.85; 2 -0.4,-0.85; 3 0.4,-0.85; 4 1.3,-0.85; 5 1.3,0.85; 6 0.4,0.85; 7 -0.4,0.85; 8 -1.3,0.85
CHIPLED_0805_NOOUTLINE = smd 1.2 x 1.2: A 0,-1.05; C 0,1.05
JSTPH2 = smd 1 x 4.6: 1 -1,-3.7; 2 1,-3.7 | smd 1.6 x 3.4: NC1 -3.4,1.5; NC2 3.4,1.5
SMA-DIODE = smd 1.27 x 1.47: A -2.15,0; C 2.15,0
LED-0603 = smd 1 x 1: A 0,-0.877; C 0,0.877
SOT23-3 = smd 0.8 x 0.9: 1 -0.95,-1; 2 0.95,-1; 3 0,1.1
SOD-123 = smd 1.4 x 1.4: A 1.85,0; C -1.85,0
SOT363 = smd 0.5 x 0.5: 1 -0.75,-0.9; 3 0.75,-0.9; 4 0.75,0.9; 6 -0.75,0.9 | smd 0.4 x 0.5: 2 0,-0.9; 5 0,0.9
SOD-323 = smd 1.35 x 0.8: A 1.27,0; C -1.27,0
PTC-1206 = smd 1 x 1.8: 1 -1.4,0; 2 1.4,0
FIDUCIAL_1MM = smd 1 x 1: 1 0,0
TSSOP14 = smd 0.35 x 0.9: 1 -1.95,-2.925; 2 -1.3,-2.925; 3 -0.65,-2.925; 4 0,-2.925; 5 0.65,-2.925; 6 1.3,-2.925; 7 1.95,-2.925; 8 1.95,2.925; 9 1.3,2.925; 10 0.65,2.925; 11 0,2.925; 12 -0.65,2.925; 13 -1.3,2.925; 14 -1.95,2.925
MOLEX-1X3_LOCK = drill 1.016 pad 1.88 square: 1 0,0.127 | drill 1.016 pad 1.88: 2 2.54,-0.127; 3 5.08,0.127
FIDUCIAL-1X2 = smd 1 x 1: 1 0,0
1X02_ROUND = drill 1 pad 1.778: 1 -1.27,0; 2 1.27,0
1X16_ROUND = drill 1 pad 1.676: 1 -19.05,0; 2 -16.51,0; 3 -13.97,0; 4 -11.43,0; 5 -8.89,0; 6 -6.35,0; 7 -3.81,0; 8 -1.27,0; 9 1.27,0; 10 3.81,0; 11 6.35,0; 12 8.89,0; 13 11.43,0; 14 13.97,0; 15 16.51,0; 16 19.05,0
CRYSTAL-SMD-5X3 = smd 1.9 x 1.1: 1 -1.85,-1.15; 2 1.85,-1.15; 3 1.85,1.15; 4 -1.85,1.15
SC59-BEC = smd 1 x 1.4: B -0.95,-1.2; C 0,1.2; E 0.95,-1.2
0603-RES = smd 1.1 x 1: 1 -0.85,0; 2 0.85,0
TACTILE-SWITCH-SMD = smd 1.524 x 0.762: 1 -2.794,1.905; 2 2.794,1.905; 3 -2.794,-1.905; 4 2.794,-1.905
PAD-JUMPER-3-2OF3_NC_BY_TRACE_YES_SILK_FULL_BOX = smd 0.635 x 1.27: 1 -0.813,0; 2 0,0; 3 0.813,0
PAD-JUMPER-2-NC_BY_TRACE_YES_SILK = smd 0.635 x 1.27: 1 -0.508,0; 2 0.508,0
BTN_KMR2_4.6X2.8 = smd 0.9 x 1: A 2.05,0.8; A' -2.05,0.8; B 2.05,-0.8; B' -2.05,-0.8
PAD.03X.05 = smd 1.27 x 1.27: P$1 0,0
TP11R = smd 1.1 x 1.1: TP 0,0
MICROSD_1:1 = smd 0.8 x 1.5: 1 5.096,10.919; 2 6.218,10.519; 3 7.274,10.853; 4 8.367,10.982; 5 9.421,10.828; 6 10.539,10.973; 7 11.648,10.819; 8 12.721,10.819 | smd 1.8 x 1.4: CD1 11.92,0.4; CD2 6.22,0.4 | smd 1.4 x 1.9: GND1 0.497,14.55; GND3 13.52,13.55
UNO_R3_SHIELD = drill 1.016 pad 1.88: 3.3V 50.8,26.67; 5V 50.8,29.21; A0 50.8,41.91; A1 50.8,44.45; A2 50.8,46.99; A3 50.8,49.53; A4 50.8,52.07; A5 50.8,54.61; AREF 2.54,15.24; D2 2.54,49.53; D3 2.54,46.99; D4 2.54,44.45; D5 2.54,41.91; D6 2.54,39.37; D7 2.54,36.83; D8 2.54,33.02; D9 2.54,30.48; D10 2.54,27.94; D11 2.54,25.4; D12 2.54,22.86; D13 2.54,20.32; GND@0 50.8,31.75; GND@1 50.8,34.29; GND@2 2.54,17.78; IOREF 50.8,21.59; NC 50.8,19.05; RES 50.8,24.13; RX 2.54,54.61; SCL 2.54,10.16; SDA 2.54,12.7; TX 2.54,52.07; VIN 50.8,36.83
JST-6-SMD-VERT-1.0MM = smd 0.6 x 1.55: 1 -2.54,1.27; 2 -1.54,1.27; 3 -0.54,1.27; 4 0.46,1.27; 5 1.46,1.27; 6 2.46,1.27 | smd 1.2 x 1.8: P$1 -3.84,-0.955; P$2 3.76,-0.955
SO-18W = smd 0.762 x 1.143: 1 -5.08,-4.788; 2 -3.81,-4.788; 3 -2.54,-4.788; 4 -1.27,-4.788; 5 0,-4.788; 6 1.27,-4.788; 7 2.54,-4.788; 8 3.81,-4.788; 9 5.08,-4.788; 10 5.08,4.788; 11 3.81,4.788; 12 2.54,4.788; 13 1.27,4.788; 14 0,4.788; 15 -1.27,4.788; 16 -2.54,4.788; 17 -3.81,4.788; 18 -5.08,4.788
SO08 = smd 0.61 x 2.21: 1 -1.905,-2.616; 2 -0.635,-2.616; 3 0.635,-2.616; 4 1.905,-2.616; 5 1.905,2.616; 6 0.635,2.616; 7 -0.635,2.616; 8 -1.905,2.616
SO016 = smd 0.6 x 1.2: 1 -4.445,-2.8; 2 -3.175,-2.8; 3 -1.905,-2.8; 4 -0.635,-2.8; 5 0.635,-2.8; 6 1.905,-2.8; 7 3.175,-2.8; 8 4.445,-2.8; 9 4.445,2.8; 10 3.175,2.8; 11 1.905,2.8; 12 0.635,2.8; 13 -0.635,2.8; 14 -1.905,2.8; 15 -3.175,2.8; 16 -4.445,2.8
JOYSTICK_MINI = smd 1.85 x 1.1: A -3.325,1.4; B 3.325,1.4; C -3.325,-1.4; CTR -3.325,0; D 3.325,-1.4; GND 3.325,0 | smd 1.9 x 2: NC 0,4.13; NC@0 0,-4.13 | hole 0.75: 0,1.9 | hole 1.05: 0,-1.9
SOT23-5 = smd 0.55 x 1.2: 1 -0.95,-1.3; 2 0,-1.3; 3 0.95,-1.3; 4 0.95,1.3; 5 -0.95,1.3
SIM900_SMT = smd 2 x 0.6: P$1 -12.4,8; P$2 -12.4,7; P$3 -12.4,6; P$4 -12.4,5; P$5 -12.4,4; P$6 -12.4,3; P$7 -12.4,2; P$8 -12.4,1; P$9 -12.4,0; P$10 -12.4,-1; P$11 -12.4,-2; P$12 -12.4,-3; P$13 -12.4,-4; P$14 -12.4,-5; P$15 -12.4,-6; P$16 -12.4,-7; P$17 -12.4,-8; P$35 12.4,-8; P$36 12.4,-7; P$37 12.4,-6; P$38 12.4,-5; P$39 12.4,-4; P$40 12.4,-3; P$41 12.4,-2; P$42 12.4,-1; P$43 12.4,0; P$44 12.4,1; P$45 12.4,2; P$46 12.4,3; P$47 12.4,4; P$48 12.4,5; P$49 12.4,6; P$50 12.4,7; P$51 12.4,8 | smd 0.6 x 2: P$18 -8,-12.4; P$19 -7,-12.4; P$20 -6,-12.4; P$21 -5,-12.4; P$22 -4,-12.4; P$23 -3,-12.4; P$24 -2,-12.4; P$25 -1,-12.4; P$26 0,-12.4; P$27 1,-12.4; P$28 2,-12.4; P$29 3,-12.4; P$30 4,-12.4; P$31 5,-12.4; P$32 6,-12.4; P$33 7,-12.4; P$34 8,-12.4; P$52 8,12.4; P$53 7,12.4; P$54 6,12.4; P$55 5,12.4; P$56 4,12.4; P$57 3,12.4; P$58 2,12.4; P$59 1,12.4; P$60 0,12.4; P$61 -1,12.4; P$62 -2,12.4; P$63 -3,12.4; P$64 -4,12.4; P$65 -5,12.4; P$66 -6,12.4; P$67 -7,12.4; P$68 -8,12.4
SCU-W0822XR-06 = smd 1.65 x 1.2: CLK -4.42,1.36; DATA 4.43,1.35; GND 4.43,-3.73; RST -4.42,-1.18; VCC -4.42,-3.72; VPP 4.43,-1.19 | smd 2.8 x 2.05: GND_1 2.05,-7.32; GND_2 -4.57,-7.32; GND_3 2.05,7.32; GND_4 -4.57,7.32
MOUNTINGHOLE_2.5_PLATED = drill 2.5 pad 3.2: P$1 0,0
DB9_MALE = drill 1.016 pad 1.88: 1 5.54,-1.42; 2 2.77,-1.42; 3 0,-1.42; 4 -2.77,-1.42; 6 4.15,1.42; 7 1.38,1.42; 8 -1.38,1.42; 9 -4.15,1.42 | drill 1.016 pad 1.88 square: 5 -5.54,-1.42 | drill 3.302 pad 5.08: G1 -12.5,0; G2 12.5,0
4UCONN_20329 = smd 1 x 2: BASE@1 -0.75,-2; BASE@2 0.75,-2 | smd 0.4 x 1.35: D+ 0,0.775; D- -0.65,0.775; GND 1.3,0.775; ID 0.65,0.775; VBUS -1.3,0.775 | drill 0.7 offset: SPRT@1 -3.3,0.9; SPRT@2 3.3,0.9 | drill 0.6 pad 2.5 square: SPRT@3 -3.6,-1.9; SPRT@4 3.6,-1.9 | hole 0.7: -1.95,0; 1.95,0
SMA_EDGELAUNCH_UFL = smd 4.064 x 1.524: GND@1 2.032,-2.54; GND@2 2.032,2.54 | smd 4.064 x 1.524 bottom: GND@3 2.032,2.54; GND@4 2.032,-2.54 | smd 2.032 x 1.016: P 3.048,0
4UCONN_18510 = smd 1.5 x 2.5: 1-GND 2.8,-3.3; 2-TIP 9.3,3.4; 3-OUTER_SLEEVE 5.5,-3.3 | smd 1.5 x 3.4: 4-INNER_SLEEVE 2.8,2.9 | hole 1.3: 10.5,0
U.FL = smd 2.2 x 1.05: 1 0,1.375; 2 0,-1.375 | smd 0.8 x 1: 3 1.525,0

### Placement (x,y rotation side)
ADC1  34.29,-105.41 0 top  (outside the outline)
C1  26.67,29.84 270 top
C2  24.77,33.02 90 top
C3  22.86,33.02 90 top
C4  45.4,33.02 270 top
C5  10.16,26.35 270 top
C6  15.24,33.02 270 top
C7  10.16,16.83 90 top
C8  31.75,12.7 90 top
C9  33.97,12.7 270 top
C10  -20.32,-153.67 0 top  (outside the outline)
C11  -13.97,-153.67 0 top  (outside the outline)
C12  -7.62,-153.67 0 top  (outside the outline)
C13  -6.35,-139.7 0 top  (outside the outline)
C14  -1.27,-153.67 0 top  (outside the outline)
C15  5.08,-153.67 0 top  (outside the outline)
C16  46.99,-137.16 0 top  (outside the outline)
C17  52.07,-137.16 0 top  (outside the outline)
C18  57.15,-137.16 0 top  (outside the outline)
C19  62.23,-137.16 0 top  (outside the outline)
CHRG  5.08,-160.02 0 top  (outside the outline)
CN2  -24.13,-142.24 0 top  (outside the outline)
D1  42.86,33.02 90 top
D2  26.35,36.83 180 top
D3  29.53,36.83 180 top
D4  32.7,36.83 180 top
D5  14.61,38.1 180 top
D6  50.8,-153.67 0 top  (outside the outline)
D7  13.97,-160.02 0 top  (outside the outline)
D8  58.42,-153.67 0 top  (outside the outline)
D9  -24.13,-160.02 0 top  (outside the outline)
D10  -16.51,-160.02 0 top  (outside the outline)
D11  -8.89,-160.02 0 top  (outside the outline)
D12  -1.27,-160.02 0 top  (outside the outline)
DONE  10.16,-160.02 0 top  (outside the outline)
F1  39.69,33.02 90 top
FID1  25.4,-158.75 0 top  (outside the outline)
FID2  29.21,-158.75 0 top  (outside the outline)
FID3  33.02,-158.75 0 top  (outside the outline)
FID4  36.83,-158.75 0 top  (outside the outline)
FID5  40.64,-158.75 0 top  (outside the outline)
FRAME1  -7.9,-24.13 0 top  (outside the outline)
FRAME2  -11.43,-25.4 0 top  (outside the outline)
IC1  -13.97,-144.78 0 top  (outside the outline)
JP1  33.02,3.81 0 top
JP2  2.54,2.54 0 top
JP3  46.99,53.34 0 top
JP4  34.16,42.23 0 top
JP6  15.24,-105.41 0 top  (outside the outline)
JP10  -1.27,-125.73 0 top  (outside the outline)
LOGO1  41.27,25.72 0 top
NETSTAT  36.83,-138.43 0 top  (outside the outline)
PWM  52.07,-105.41 0 top  (outside the outline)
PWRSTAT  41.91,-138.43 0 top  (outside the outline)
Q1  10.16,21.59 270 top
Q2  8.89,-138.43 0 top  (outside the outline)
R1  34.61,36.83 270 top
R2  27.94,36.83 270 top
R3  31.11,36.83 270 top
R4  11.43,-153.67 0 top  (outside the outline)
R5  17.78,-153.67 0 top  (outside the outline)
R6  24.13,-153.67 0 top  (outside the outline)
R7  30.48,-153.67 0 top  (outside the outline)
R8  36.83,-153.67 0 top  (outside the outline)
R9  43.18,-153.67 0 top  (outside the outline)
R10  24.77,36.83 90 top
R12  22.86,36.83 90 top
R13  12.06,36.83 270 top
S2  44.45,3.81 0 top
SJ1  8.89,11.43 90 top
SJ2  13.97,11.43 90 top
SJ3  3.81,5.08 90 top
SJ4  32.07,46.04 180 top
SJ5  26.67,46.04 180 top
SJ6  21.27,46.04 180 top
SW1  -25.4,-154.94 0 top  (outside the outline)
TP1  12.7,27.94 0 bottom
TP2  12.7,30.48 0 bottom
TP3  20.32,-160.02 0 top  (outside the outline)
U1  30.48,16.51 180 top
U2  0,0 0 top
U3  10.16,3.81 0 top
U4  19.05,24.13 270 top
U5  19.05,35.56 0 top
U6  33.02,24.13 270 top
U7  44.96,13.46 315 top
U8  25.4,-138.43 0 top  (outside the outline)
U9  99.06,20.32 0 top
U$1  3.81,-26.67 0 top  (outside the outline)
U$25  133.35,11.43 0 top
U$33  -10.16,-45.72 0 top  (outside the outline)
U$34  25.4,-45.72 0 top  (outside the outline)
X1  26.67,50.8 0 top
X2  19.05,-74.93 0 top  (outside the outline)
X3  35.56,-124.46 0 top  (outside the outline)
X4  46.99,-125.73 0 top  (outside the outline)
X5  2.54,-138.43 0 top  (outside the outline)

### Tracks (layer width: path | path; a pad name or v marks a point on that pad's centre or on a via)
1.8V  (2 unrouted)
2.8V  (2 unrouted)
3.3V
  Top 0.254: U6.1 32.38,28.57 33.02,27.94 33.97,27.94 | 33.97,27.94 49.53,27.94 U2.3.3V | 33.97,27.94 C9.1 C8.2 27.01,13.55 22.11,8.65 U1.4
5V  (via drill 0.51)  (1 unrouted)
  Top 0.254: U4.18 23.88,29.21 | D4.A 32.63,37.71 | 19.62,29.46 19.68,29.53
  Top 0.406: C6.2 15.24,30.48 15.88,29.84 19.68,29.84 | v8.89,3.56 8.62,3.83 U3.2 | U2.5V 39.24,29.21 38.39,30.06 35.56,30.06 29.74,30.06 28.68,29 C1.2 26.45,29.21 U4.18 22.86,29.21 22.54,28.89 22.54,28.13 v22.35,27.94 | U5.3 19.68,29.84 | 19.68,29.84 19.68,29.53 19.68,29.08 v19.81,28.96 | 33.02,40.64 32.7,40.32 D4.A
  Bottom 0.406: JP1.1 32.83,4.13 22.23,4.13 | 22.23,4.13 9.46,4.13 v8.89,3.56 | 22.23,4.13 22.35,4.25 v22.35,27.94 20.64,27.94 19.81,28.77 v19.81,28.96
12V
  Top 0.61: U2.VIN 50.48,36.51 43.18,36.51 42.86,36.2 D1.C 42.94,35.24 45.09,35.24 45.4,34.92 C4.1
+5V  (4 unrouted)
CAN_CS  (via drill 0.51)
  Top 0.254: U4.16 v19.37,26.67
  Bottom 0.254: U2.D10 3.49,27.94 4.76,26.67 v19.37,26.67
CAN_INT  (via drill 0.51)
  Top 0.254: U4.12 v25.53,21.59 | v22.35,30.73 21.84,31.24 21.84,34.16 20.95,35.05 v20.32,35.05 | U2.D2 v6.16,49.53
  Bottom 0.254: v22.35,30.73 22.61,30.48 24.26,30.48 26.04,28.7 26.04,22.1 v25.53,21.59 | v20.32,35.05 20.32,38.1 8.89,49.53 v6.16,49.53
CAN_RXD  (via drill 0.51)
  Top 0.254: U5.4 20.95,28.57 20.32,27.94 v17.78,27.94 U4.2
  Bottom 0.254: TP1.P$1 v17.78,27.94
CAN_TXD  (via drill 0.51)
  Top 0.254: U4.1 15.88,29.21 v16.26,28.83 | U5.1 17.14,31.43 v16.51,30.8
  Bottom 0.254: v16.51,30.8 16.51,29.08 v16.26,28.83 14.35,28.83 TP2.P$1
CANH  (via drill 0.51)
  Top 0.254: v22.86,39.18 R12.2 22.12,37.68 21.91,37.47 21.91,36.83 21.59,36.51 18.73,36.51 18.41,36.83 U5.7 18.41,40.01 18.1,40.32 15.88,40.32 15.55,40 D5.1 | SJ4.2 32.07,44.13 31.75,43.81 v29.53,43.81
  Bottom 0.254: v22.86,39.18 22.86,41.27 25.4,43.81 v29.53,43.81 39.37,43.81 40.64,42.55
CANL  (via drill 0.51)
  Top 0.254: R10.2 24.77,40.32 23.81,41.27 v21.27,41.27 19.68,41.27 | D5.2 13.65,40.64 14.29,41.27 19.68,41.27 | U5.6 19.68,41.27 | 20.64,46.04 SJ6.2 21.34,45.97 21.34,44.45 21.08,44.2 18.8,44.2 v18.73,44.26
  Bottom 0.254: 43.18,43.18 41.59,44.77 19.24,44.77 v18.73,44.26 18.73,42.23 19.68,41.27 v21.27,41.27
D4
  Top 0.254: U2.D4 3.17,44.45 3.81,43.81 3.81,43.05 3.81,42.93 3.81,38.61 3.3,38.1 1.65,38.1 1.27,37.72 1.27,16.89 1.65,16.51 6.67,16.51 10.94,12.24 SJ2.3
D5
  Top 0.254: U2.D5 0.76,40.13 0.76,14.73 1.52,13.97 4.83,13.97 6.6,12.19 8.84,12.19 SJ1.3
GND  (via drill 0.51)  (100 unrouted)
  Top 0.254: U3.1 7.62,3.81
  other vias: 27.75,39.88 9.97,34.61 31.11,40.01 33.66,32.07 33.97,39.05 13.65,16.51 18.41,30.8
  pour Bottom (isolate 0.305): 0,0 0,59.69 53.34,59.69 53.34,0
  pour Top (isolate 0.305): 0,0 0,59.69 53.34,59.69 53.34,0
GSM_ANT  (1 unrouted)
HP+  (2 unrouted)
JOY-CLICK
  Top 0.254: U2.A4 52.2,50.67 52.2,21.08 51.44,20.32 49.53,20.32 44.13,14.92 43.5,14.92 U7.CTR | U7.CTR
JOY-DOWN  (via drill 0.51)
  Top 0.254: U7.D 44.58,8.38 v43.81,8.38
  Bottom 0.254: 38.35,30.48 38.35,13.84 v43.81,8.38 | 38.35,30.48 38.35,31.24 | U2.A3 46.35,45.09 46.35,40.32 38.42,32.38 38.42,30.54 38.35,30.48
JOY-LEFT  (via drill 0.51)
  Top 0.254: v39.69,17.14 39.69,16.75 U7.C
  Bottom 0.254: U2.A2 48.01,44.2 48.01,40.26 39.75,32 39.75,17.21 v39.69,17.14
JOY-RIGHT
  Top 0.254: U2.A5 52.7,52.7 52.7,16.51 U7.B
JOY-UP  (via drill 0.51)
  Top 0.254: 40.64,21.11 v40.64,21.08 40.64,19.76 U7.A
  Bottom 0.254: v40.64,21.08 40.64,31.75 48.9,40.01 48.9,42.86 50.48,44.45 U2.A1
LCD
  Bottom 0.254: U2.D6 0.76,37.59 0.76,36.83 0.76,8.13 2.54,6.35 6.35,6.35 7.62,5.08 7.62,3.05 8.38,2.29 36.96,2.29 38.1,3.43 JP1.3
LED1
  Top 0.254: D2.A 26.35,40.64 24.83,42.16 10.35,42.16 2.54,34.35 U2.D8
LED2
  Top 0.254: U2.D7 3.81,36.83 9.78,42.8 27.05,42.8 29.53,40.32 D3.A
MIC1+  (6 unrouted)
MIC1-  (9 unrouted)
MISO  (via drill 0.51)
  Top 0.254: v18.8,14.48 18.8,5.73 U1.7 | U4.15 19.05,25.4 17.78,24.13 v17.02,24.13
  Bottom 0.254: v18.8,14.48 18.8,22.35 v17.02,24.13 3.81,24.13 U2.D12
MOSI  (via drill 0.51)
  Top 0.254: v20.83,24.38 21.08,24.13 U4.14 26.67,24.13 27.3,23.5 U6.5
  Bottom 0.254: v20.83,24.38 19.81,25.4 U2.D11
N$1
  Top 0.254: U3.5 11.62,1.46 11.43,1.27 5.08,1.27 3.81,2.54 SJ3.1
N$2
  Top 0.254: SJ6.3 20.46,48.71 X1.5
N$3  (1 unrouted)
N$4
  Top 0.254: D4.C 34.58,35.95 R1.2
N$5
  Top 0.254: D2.C 27.91,35.95 R2.2
N$6
  Top 0.254: D3.C 31.09,35.95 R3.2
N$7  (2 unrouted)
N$8  (1 unrouted)
N$9
  Top 0.254: R10.1 C2.2
N$10
  Top 0.254: R12.1 C3.2
N$11  (1 unrouted)
N$12  (1 unrouted)
N$13
  Top 0.61: F1.2 39.69,37.15 40.32,37.78 43.81,37.78 45.4,39.37 45.4,50.16 40.32,55.24 23.5,55.24 22.52,54.27 X1.9
N$14
  Top 0.254: U5.8 17.14,36.2 16.83,35.88 12.17,35.88 R13.2
N$15  (via drill 0.51)
  Top 0.254: U6.2 28.07,27.3 v27.94,27.18 | v26.92,10.29 26.29,10.29 24.26,8.26 U1.2
  Bottom 0.254: v27.94,27.18 26.67,25.91 26.67,10.54 v26.92,10.29
N$16
  Top 0.61: F1.1 42.11,31.62 D1.A
N$17
  Top 0.254: 11.31,19.69 11.3,19.68 | Q1.3 11.31,19.69 | 11.31,19.69 11.31,17.98 11.11,17.78 10.26,17.78 C7.2 | 11.31,19.69 12.07,19.69 12.7,20.32 U4.8
N$18
  Top 0.254: 9.02,23.5 9.01,23.49 Q1.1 8.89,23.56 | 9.02,23.5 9.02,22.1 9.53,21.59 U4.7 | C5.2 10.06,25.4 9.53,25.4 9.02,24.89 9.02,23.5
N$19  (via drill 0.51)
  Top 0.254: U6.4 27.81,24.77 v27.69,24.64 | v27.69,12 26.73,12 23.21,8.47 U1.3
  Bottom 0.254: v27.69,12 v27.69,24.64
N$20  (1 unrouted)
N$21
  Top 0.254: SJ1.2 10.29,11.43 10.67,11.05 10.67,8.13 9.62,7.08 U3.3
N$22
  Top 0.254: SJ2.2 12.7,11.43 11.43,10.16 11.43,7.62 10.79,6.99 10.62,6.81 U3.4
N$23  (2 unrouted)
N$24
  Top 0.254: U6.6 30.99,22.23 31.24,21.97 31.24,19.3 21.05,9.11 U1.5
N$25  (1 unrouted)
N$26  (1 unrouted)
NETSTAT  (1 unrouted)
NETSTAT_5V  (2 unrouted)
PIN2  (via drill 0.51)
  Top 0.254: SJ6.1 v24.13,46.04 SJ5.3
  Bottom 0.254: X1.2 29.44,47.22 28.26,46.04 v24.13,46.04
PIN3
  Top 0.254: X1.3 27.48,48.57 SJ5.1 SJ4.3
PIN7
  Top 0.254: X1.7 28.09,52.22 29.53,53.66 32.07,53.66 33.97,51.75 33.97,48.26 32.88,47.17 SJ4.1
PWM1  (2 unrouted)
PWRKEY  (3 unrouted)
PWRKEY_5V  (1 unrouted)
PWRSTAT  (1 unrouted)
PWRSTAT_5V  (2 unrouted)
RESET  (1 unrouted)
RESET_5V  (1 unrouted)
RI  (1 unrouted)
RI_5V  (1 unrouted)
RS  (via drill 0.51)
  Top 0.254: v27.94,25.91 27.43,25.91 25.4,27.94 U4.17 | v41.91,4.57 41.91,2.16 S2.3
  Bottom 0.254: U2.RES 52.58,22.35 52.58,9.02 48.13,4.57 v41.91,4.57 32.7,13.78 32.7,22.54 29.34,25.91 v27.94,25.91
RTS  (2 unrouted)
RTS_5V  (1 unrouted)
RX  (via drill 0.51)
  Top 0.254: SJ2.1 v13.97,7.87
  Bottom 0.254: U2.RX 1.27,53.34 1.27,53.09 1.27,51.18 1.65,50.8 3.3,50.8 3.81,50.29 3.81,36.2 1.27,33.66 1.27,11.94 1.4,11.81 1.27,11.68 1.27,8.89 2.54,7.62 13.72,7.62 v13.97,7.87
RXD_5V  (1 unrouted)
SCK  (via drill 0.51)
  Top 0.254: U6.7 28.45,20.95 26.54,22.86 U4.13 19.81,22.86 v17.78,20.83
  Bottom 0.254: v17.78,20.83 3.05,20.83 U2.D13
SD_CS  (via drill 0.51)
  Top 0.254: v31.81,26.86 31.75,26.8 31.75,26.35 31.43,26.04 U6.3
  Bottom 0.254: U2.D9 5.08,30.48 7.62,33.02 30.48,33.02 31.75,31.75 31.75,26.92 v31.81,26.86
SIMCLK  (2 unrouted)
SIMDATA  (2 unrouted)
SIMRST  (2 unrouted)
SPEAKER1+  (6 unrouted)
SPEAKER1-  (10 unrouted)
TX  (via drill 0.51)
  Top 0.254: v4.32,19.05 v4.32,32 | SJ1.1 7.16,10.62 6.35,11.43 v5.08,11.43
  Bottom 0.254: v4.32,32 4.32,50.93 3.17,52.07 U2.TX | v5.08,11.43 5.08,11.94 4.32,12.7 v4.32,19.05
TXD_5V  (1 unrouted)
UART_RXD  (1 unrouted)
UART_TXD  (1 unrouted)
VBAT  (11 unrouted)
VCCIO  (1 unrouted)
VRTC  (1 unrouted)

### Text on the board
Bottom: www.skpang.co.uk | v13
tPlace: OBDII | CAN | OBDII | CAN | OBDII | CAN | 5V | GND | CAN | CAN | H | L | D8 | D7 | PWR | CAN-BUS Shield | U | D5 | D4 | R | L | TX | RX | GND | LCD | D | GPS | Reset
tNames: RESET
Measures: Units: inches
tDocu: Sukkin Pang | Toni Klopfenstein